# EAGLE design QuadFM (EAGLE 7.6.0)
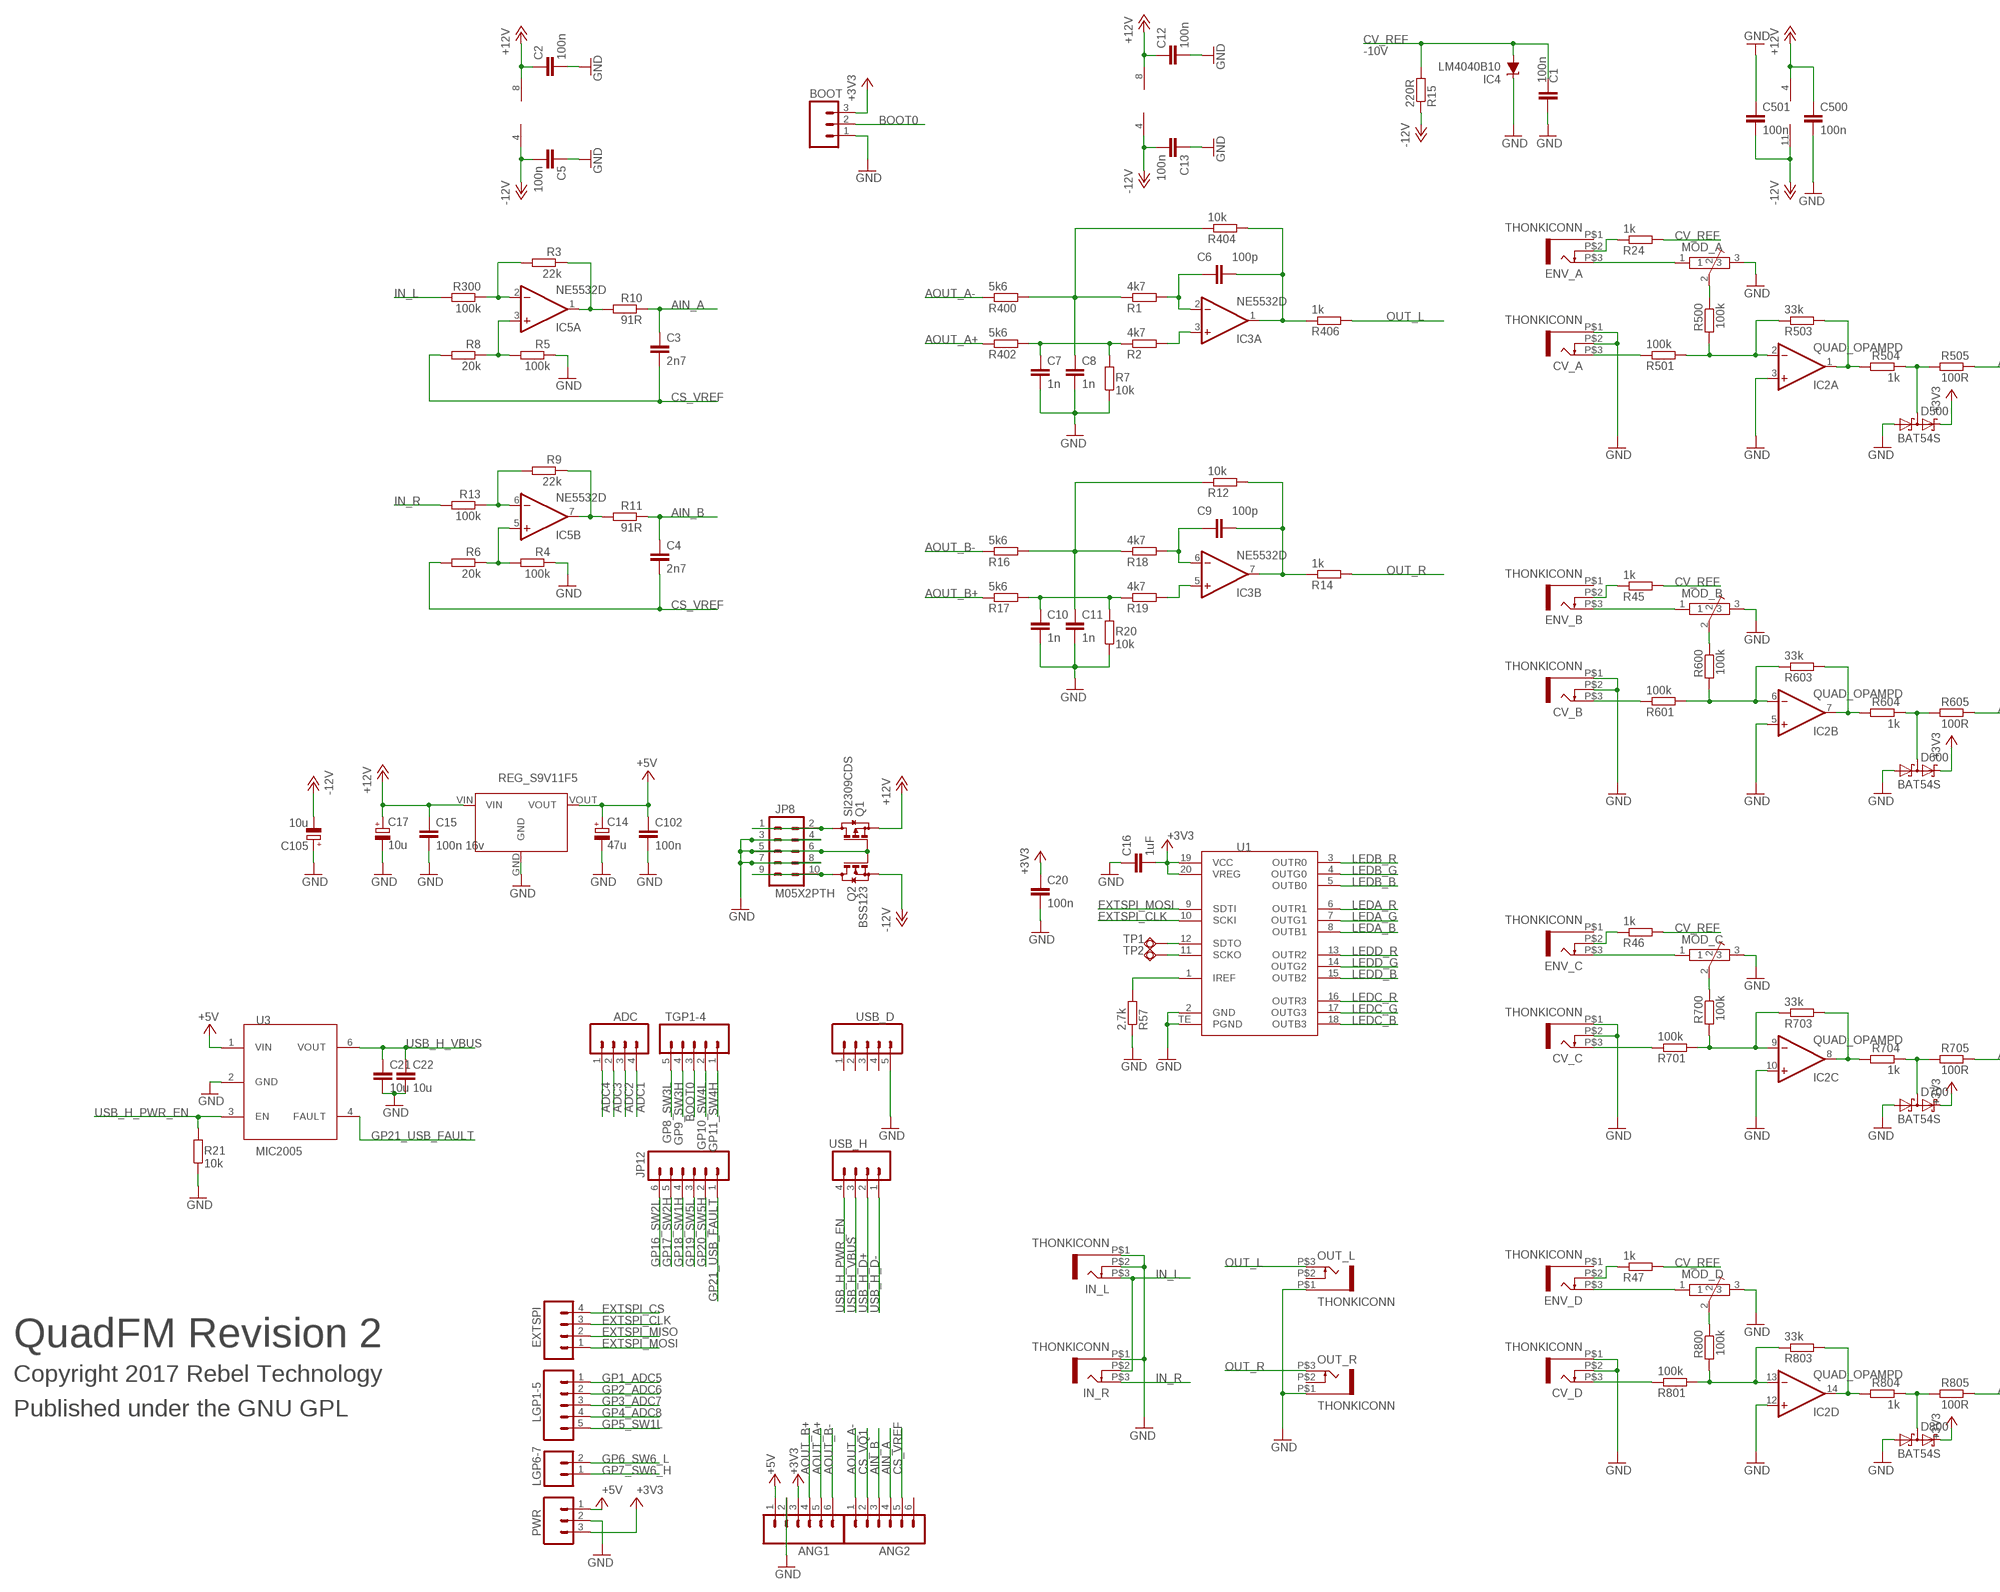
[diagram p0: schematic, sheet 1, part 1 of 2]
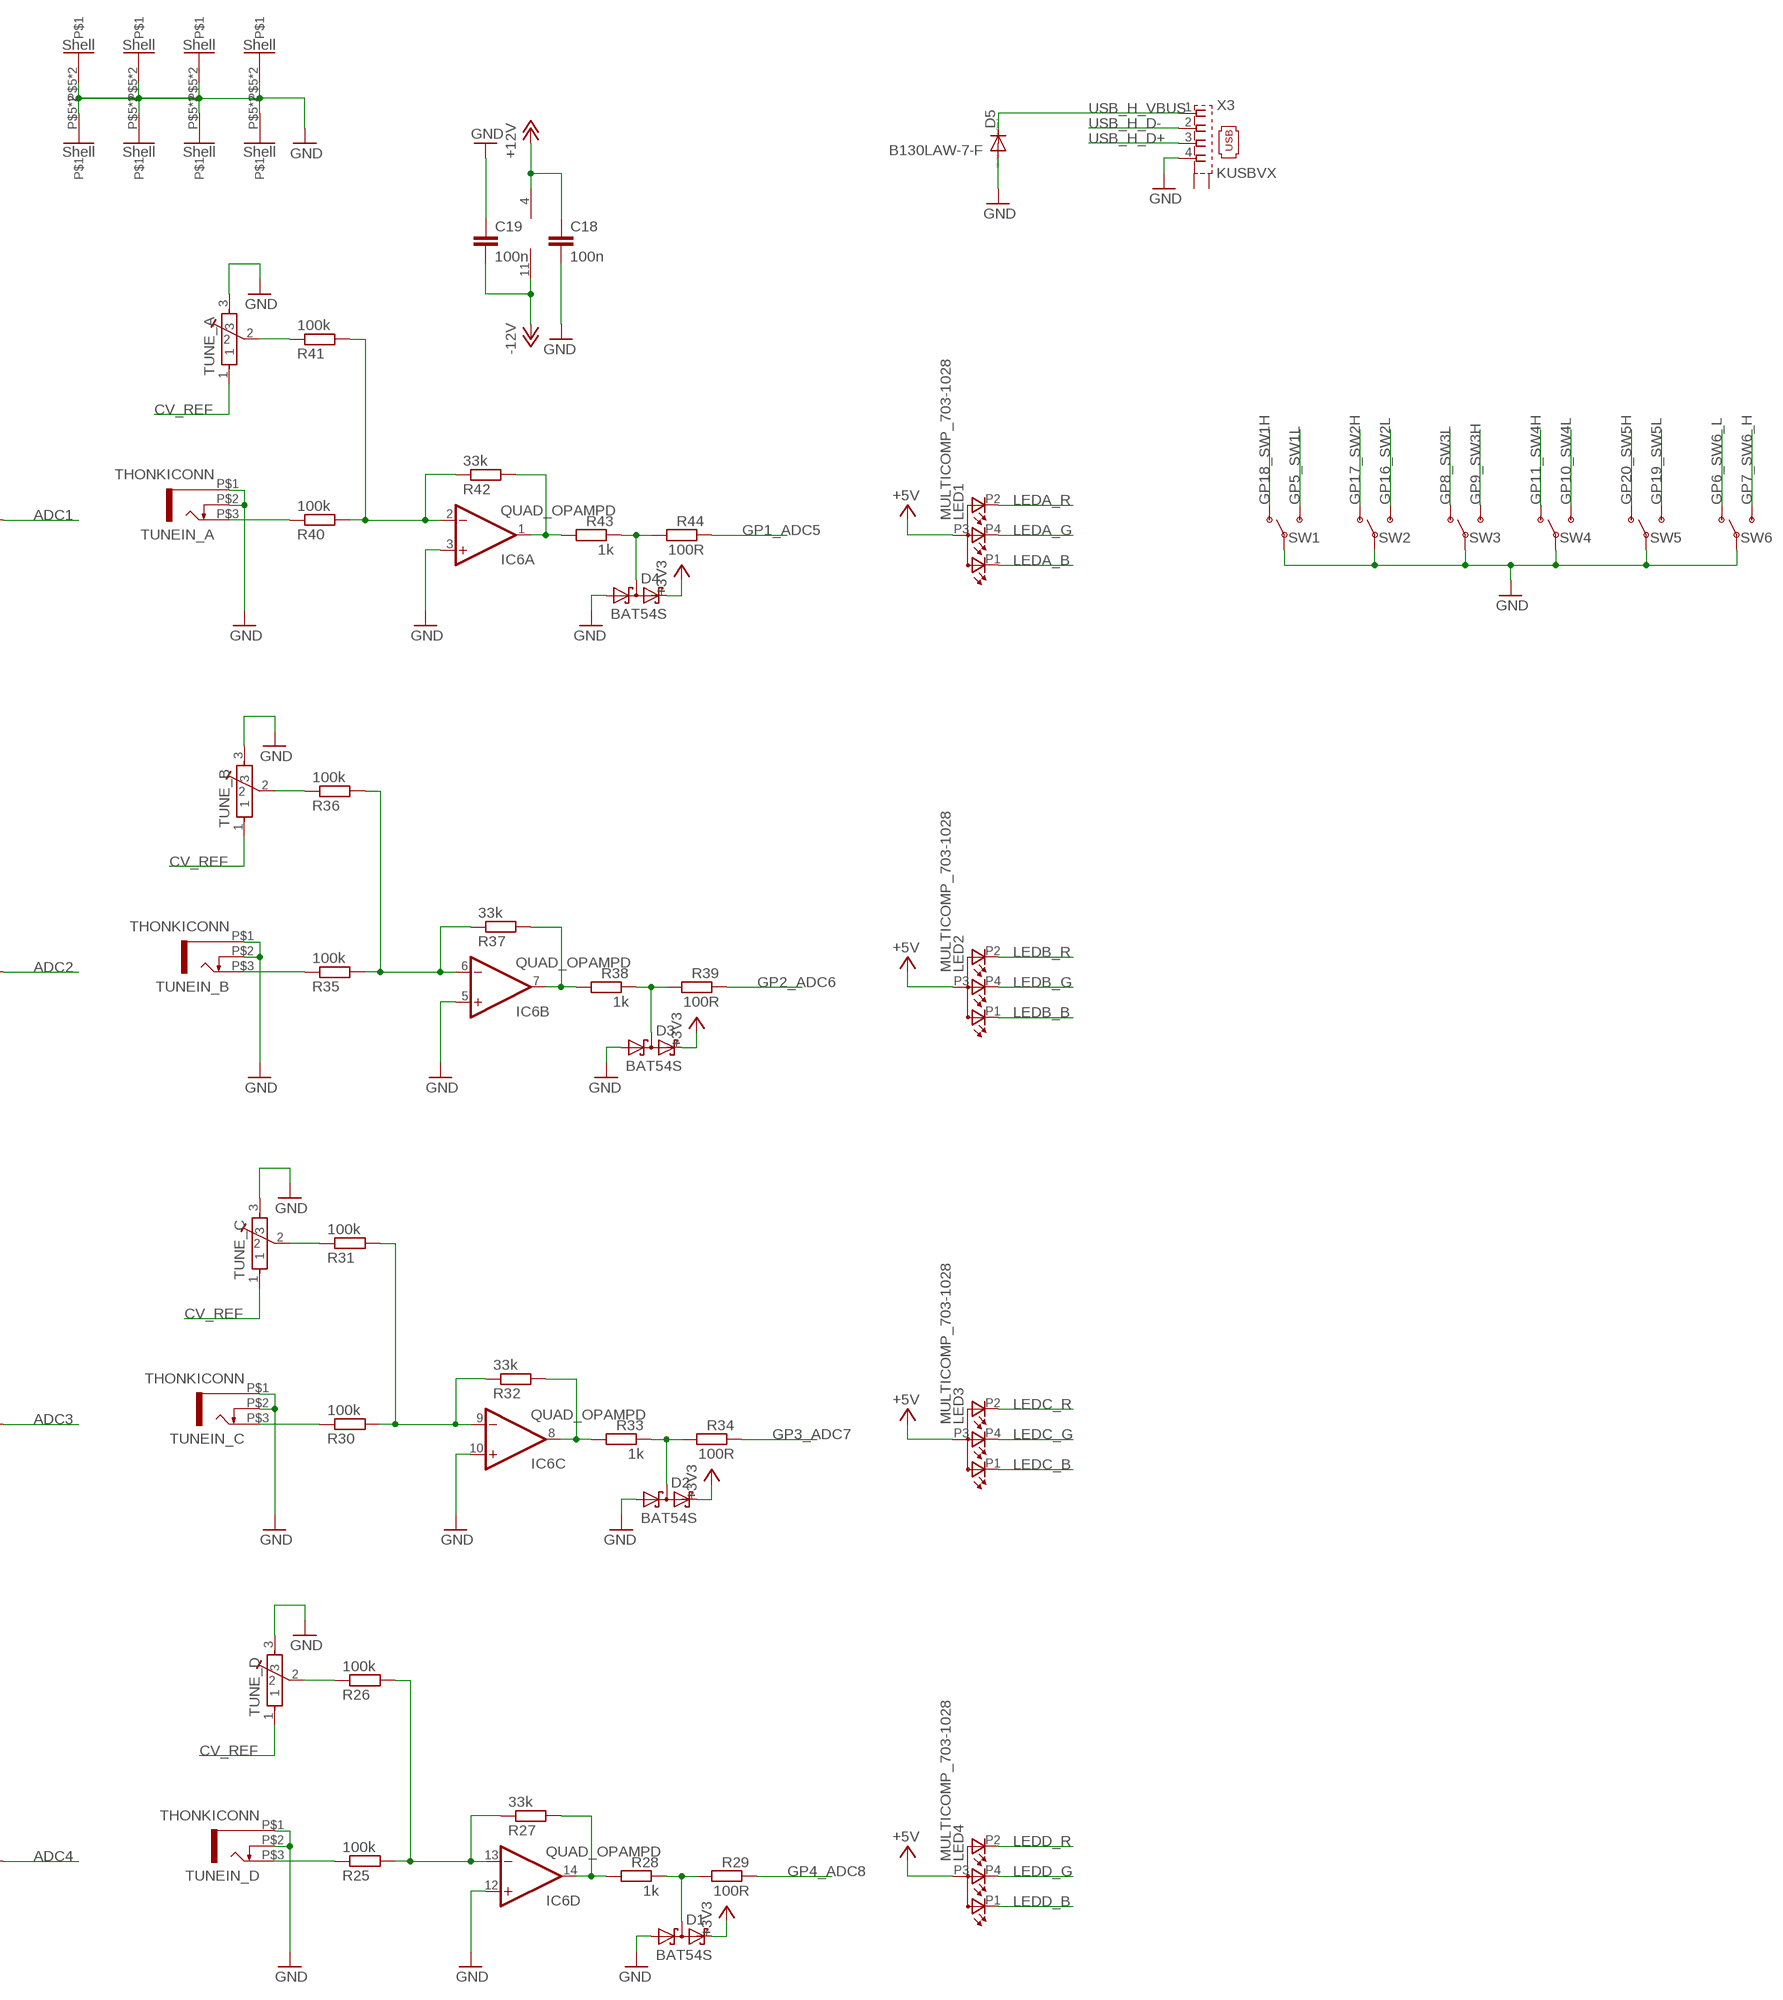
[diagram p1: schematic, sheet 1, part 2 of 2]

## Parts
ADC  M04PTH  [1X04]
ANG1  M06SIP  [1X06]
ANG2  M06SIP  [1X06]
BOOT  M03PTH  [1X03]
C1  100n  C-EUC0603  [C0603]
C2  100n  C-EUC0603  [C0603]
C3  2n7  C-EUC0603  [C0603]
C4  2n7  C-EUC0603  [C0603]
C5  100n  C-EUC0603  [C0603]
C6  100p  C-EUC0603  [C0603]
C7  1n  C-EUC0603  [C0603]
C8  1n  C-EUC0603  [C0603]
C9  100p  C-EUC0603  [C0603]
C10  1n  C-EUC0603  [C0603]
C11  1n  C-EUC0603  [C0603]
C12  100n  C-EUC0603  [C0603]
C13  100n  C-EUC0603  [C0603]
C14  47u  CPOL-EU153CLV-0505  [CPOL-5]
C15  100n 16v  C-EUC0603  [C0603]
C16  1uF  C-EUC0603  [C0603]
C17  10u  CPOL-EU153CLV-0405  [153CLV-0405]
C18  100n  C-EUC0603  [C0603]
C19  100n  C-EUC0603  [C0603]
C20  100n  C-EUC0603  [C0603]
C21  10u  C-EUC0603  [C0603]
C22  10u  C-EUC0603  [C0603]
C102  100n  C-EUC0603  [C0603]
C105  10u  CPOL-EU153CLV-0405  [153CLV-0405]
C500  100n  C-EUC0603  [C0603]
C501  100n  C-EUC0603  [C0603]
CV_A  THONKICONN  [THONKICONN]
CV_B  THONKICONN  [THONKICONN]
CV_C  THONKICONN  [THONKICONN]
CV_D  THONKICONN  [THONKICONN]
D1  BAT54S  [SOT23]
D2  BAT54S  [SOT23]
D3  BAT54S  [SOT23]
D4  BAT54S  [SOT23]
D5  B130LAW-7-F  DIODE-SOD123  [SOD123]
D500  BAT54S  [SOT23]
D600  BAT54S  [SOT23]
D700  BAT54S  [SOT23]
D800  BAT54S  [SOT23]
ENV_A  THONKICONN  [THONKICONN]
ENV_B  THONKICONN  [THONKICONN]
ENV_C  THONKICONN  [THONKICONN]
ENV_D  THONKICONN  [THONKICONN]
EXTSPI  M04PTH  [1X04]
IC2  QUAD_OPAMPD  [SO14]
IC3  NE5532D  [SO08]
IC4  LM4040B10  LM4041C12DBZ  [DBZ_R-PDSO-G3]
IC5  NE5532D  [SO08]
IC6  QUAD_OPAMPD  [SO14]
IN_L  THONKICONN  [THONKICONN]
IN_R  THONKICONN  [THONKICONN]
JP8  M05X2PTH  [AVR_ICSP]
JP12  M06SIP  [1X06]
LED1  MULTICOMP_703-1028  [RGB-LED-703-1028]
LED2  MULTICOMP_703-1028  [RGB-LED-703-1028]
LED3  MULTICOMP_703-1028  [RGB-LED-703-1028]
LED4  MULTICOMP_703-1028  [RGB-LED-703-1028]
LGP1-5  M05PTH  [1X05]
LGP6-7  M02PTH  [1X02]
MOD_A  POT-ALPS-RK09L1140  [POT-ALPS-RK09L1140]
MOD_B  POT-ALPS-RK09L1140  [POT-ALPS-RK09L1140]
MOD_C  POT-ALPS-RK09L1140  [POT-ALPS-RK09L1140]
MOD_D  POT-ALPS-RK09L1140  [POT-ALPS-RK09L1140]
OUT_L  THONKICONN  [THONKICONN]
OUT_R  THONKICONN  [THONKICONN]
PWR  M03PTH  [1X03]
Q1  SI2309CDS  BSS84  [SOT23]
Q2  BSS123  [SOT23]
R1  4k7  R-EU_0603  [0603]
R2  4k7  R-EU_0603  [0603]
R3  22k  R-EU_0603  [0603]
R4  100k  R-EU_0603  [0603]
R5  100k  R-EU_0603  [0603]
R6  20k  R-EU_0603  [0603]
R7  10k  R-EU_0603  [0603]
R8  20k  R-EU_0603  [0603]
R9  22k  R-EU_0603  [0603]
R10  91R  R-EU_0603  [0603]
R11  91R  R-EU_0603  [0603]
R12  10k  R-EU_0603  [0603]
R13  100k  R-EU_0603  [0603]
R14  1k  R-EU_0603  [0603]
R15  220R  R-EU_0603  [0603]
R16  5k6  R-EU_0603  [0603]
R17  5k6  R-EU_0603  [0603]
R18  4k7  R-EU_0603  [0603]
R19  4k7  R-EU_0603  [0603]
R20  10k  R-EU_0603  [0603]
R21  10k  R-EU_0603  [0603]
R24  1k  R-EU_0603  [0603]
R25  100k  R-EU_0603  [0603]
R26  100k  R-EU_0603  [0603]
R27  33k  R-EU_0603  [0603]
R28  1k  R-EU_0603  [0603]
R29  100R  R-EU_0603  [0603]
R30  100k  R-EU_0603  [0603]
R31  100k  R-EU_0603  [0603]
R32  33k  R-EU_0603  [0603]
R33  1k  R-EU_0603  [0603]
R34  100R  R-EU_0603  [0603]
R35  100k  R-EU_0603  [0603]
R36  100k  R-EU_0603  [0603]
R37  33k  R-EU_0603  [0603]
R38  1k  R-EU_0603  [0603]
R39  100R  R-EU_0603  [0603]
R40  100k  R-EU_0603  [0603]
R41  100k  R-EU_0603  [0603]
R42  33k  R-EU_0603  [0603]
R43  1k  R-EU_0603  [0603]
R44  100R  R-EU_0603  [0603]
R45  1k  R-EU_0603  [0603]
R46  1k  R-EU_0603  [0603]
R47  1k  R-EU_0603  [0603]
R57  2.7k  R-EU_0603  [0603]
R300  100k  R-EU_0603  [0603]
R400  5k6  R-EU_0603  [0603]
R402  5k6  R-EU_0603  [0603]
R404  10k  R-EU_0603  [0603]
R406  1k  R-EU_0603  [0603]
R500  100k  R-EU_0603  [0603]
R501  100k  R-EU_0603  [0603]
R503  33k  R-EU_0603  [0603]
R504  1k  R-EU_0603  [0603]
R505  100R  R-EU_0603  [0603]
R600  100k  R-EU_0603  [0603]
R601  100k  R-EU_0603  [0603]
R603  33k  R-EU_0603  [0603]
R604  1k  R-EU_0603  [0603]
R605  100R  R-EU_0603  [0603]
R700  100k  R-EU_0603  [0603]
R701  100k  R-EU_0603  [0603]
R703  33k  R-EU_0603  [0603]
R704  1k  R-EU_0603  [0603]
R705  100R  R-EU_0603  [0603]
R800  100k  R-EU_0603  [0603]
R801  100k  R-EU_0603  [0603]
R803  33k  R-EU_0603  [0603]
R804  1k  R-EU_0603  [0603]
R805  100R  R-EU_0603  [0603]
SW1  SUB-MIN-SPDT  [SUB-MIN-SPDT]
SW2  SUB-MIN-SPDT  [SUB-MIN-SPDT]
SW3  SUB-MIN-SPDT  [SUB-MIN-SPDT]
SW4  SUB-MIN-SPDT  [SUB-MIN-SPDT]
SW5  SUB-MIN-SPDT  [SUB-MIN-SPDT]
SW6  SUB-MIN-SPDT  [SUB-MIN-SPDT]
TGP1-4  M05PTH  [1X05]
TP1  TPSQPAD1-13  [P1-13]
TP2  TPSQPAD1-13  [P1-13]
TUNE_A  POT-ALPS-RK09L1140  [POT-ALPS-RK09L1140]
TUNE_B  POT-ALPS-RK09L1140  [POT-ALPS-RK09L1140]
TUNE_C  POT-ALPS-RK09L1140  [POT-ALPS-RK09L1140]
TUNE_D  POT-ALPS-RK09L1140  [POT-ALPS-RK09L1140]
TUNEIN_A  THONKICONN  [THONKICONN]
TUNEIN_B  THONKICONN  [THONKICONN]
TUNEIN_C  THONKICONN  [THONKICONN]
TUNEIN_D  THONKICONN  [THONKICONN]
U1  TLC5971  TLC5971QFN  [TSSOP20-TE]
U3  MIC2005  [SOT23-6]
U$1  REG_S9V11F5  [REG_S9V11F5]
USB_D  M05PTH  [1X05]
USB_H  M04PTH  [1X04]
X3  KUSBVX  [KUSBVX]

## Nets
+3V3: ANG1.3 BOOT.3 C16.2 C20.1 D1.2(C2) D2.2(C2) D3.2(C2) D4.2(C2) D500.2(C2) D600.2(C2) D700.2(C2) D800.2(C2) PWR.3 U1.19(VCC) U1.20(VREG)
+5V: ANG1.1 C14.+ C102.1 LED1.P3(A) LED2.P3(A) LED3.P3(A) LED4.P3(A) PWR.1 U3.1(VIN) U$1.VOUT
+12V: C2.1 C12.1 C15.1 C17.+ C18.1 C500.1 IC2.4(P:V+) IC3.8(P:V+) IC5.8(P:V+) IC6.4(P:V+) Q1.2(S) U$1.VIN
-12V: C5.2 C13.2 C19.2 C105.- C501.2 IC2.11(P:V-) IC3.4(P:V-) IC5.4(P:V-) IC6.11(P:V-) Q2.2(S) R15.1
ADC1: ADC.4 R505.1
ADC2: ADC.3 R605.1
ADC3: ADC.2 R705.1
ADC4: ADC.1 R805.1
AIN_A: ANG2.4 C3.1 R10.1
AIN_B: ANG2.3 C4.1 R11.1
AOUT_A+: ANG1.5 R402.1
AOUT_A-: ANG2.1 R400.1
AOUT_B+: ANG1.4 R17.1
AOUT_B-: ANG1.6 R16.1
BOOT0: BOOT.2 TGP1-4.3
CS_VQ1: ANG2.2
CS_VREF: ANG2.5 C3.2 C4.2 R6.2 R8.2
CV_REF: C1.1 IC4.2(A) R15.2 R24.2 R45.2 R46.2 R47.2 TUNE_A.1 TUNE_B.1 TUNE_C.1 TUNE_D.1
EXTSPI_CLK: EXTSPI.3 U1.10(SCKI)
EXTSPI_CS: EXTSPI.4
EXTSPI_MISO: EXTSPI.2
EXTSPI_MOSI: EXTSPI.1 U1.9(SDTI)
GND: ANG1.2 BOOT.1 C1.2 C2.2 C5.1 C7.2 C8.2 C10.2 C11.2 C12.2 C13.1 C14.- C15.2 C16.1 C17.- C18.2 C19.1 C20.2 C21.2 C22.2 C102.2 C105.+ C500.2 C501.1 CV_A.P$1 CV_A.P$2 CV_B.P$1 CV_B.P$2 CV_C.P$1 CV_C.P$2 CV_D.P$1 CV_D.P$2 D1.1(A1) D2.1(A1) D3.1(A1) D4.1(A1) D5.A D500.1(A1) D600.1(A1) D700.1(A1) D800.1(A1) IC2.3(A:+IN) IC2.5(B:+IN) IC2.10(C:+IN) IC2.12(D:+IN) IC4.1(C) IC6.3(A:+IN) IC6.5(B:+IN) IC6.10(C:+IN) IC6.12(D:+IN) IN_L.P$1 IN_L.P$2 IN_R.P$1 JP8.3 JP8.4 JP8.5 JP8.6 JP8.7 JP8.8 MOD_A.3 MOD_A.P$5 MOD_A.P$6 MOD_B.3 MOD_B.P$5 MOD_B.P$6 MOD_C.3 MOD_C.P$5 MOD_C.P$6 MOD_D.3 MOD_D.P$5 MOD_D.P$6 OUT_L.P$1 OUT_R.P$1 PWR.2 Q1.1(G) Q2.1(G) R4.1 R5.1 R7.1 R20.1 R21.1 R57.1 SW1.2(P) SW2.2(P) SW3.2(P) SW4.2(P) SW5.2(P) SW6.2(P) TUNE_A.3 TUNE_A.P$5 TUNE_A.P$6 TUNE_B.3 TUNE_B.P$5 TUNE_B.P$6 TUNE_C.3 TUNE_C.P$5 TUNE_C.P$6 TUNE_D.3 TUNE_D.P$5 TUNE_D.P$6 TUNEIN_A.P$1 TUNEIN_A.P$2 TUNEIN_B.P$1 TUNEIN_B.P$2 TUNEIN_C.P$1 TUNEIN_C.P$2 TUNEIN_D.P$1 TUNEIN_D.P$2 U1.2(GND) U1.TE(PGND) U3.2(GND) U$1.GND USB_D.5 X3.4
GP1_ADC5: LGP1-5.1 R44.1
GP2_ADC6: LGP1-5.2 R39.1
GP3_ADC7: LGP1-5.3 R34.1
GP4_ADC8: LGP1-5.4 R29.1
GP5_SW1L: LGP1-5.5 SW1.3(S)
GP6_SW6_L: LGP6-7.2 SW6.1(O)
GP7_SW6_H: LGP6-7.1 SW6.3(S)
GP8_SW3L: SW3.1(O) TGP1-4.5
GP9_SW3H: SW3.3(S) TGP1-4.4
GP10_SW4L: SW4.3(S) TGP1-4.2
GP11_SW4H: SW4.1(O) TGP1-4.1
GP16_SW2L: JP12.6 SW2.3(S)
GP17_SW2H: JP12.5 SW2.1(O)
GP18_SW1H: JP12.4 SW1.1(O)
GP19_SW5L: JP12.3 SW5.3(S)
GP20_SW5H: JP12.2 SW5.1(O)
GP21_USB_FAULT: JP12.1 U3.4(FAULT)
IN_L: IN_L.P$3 IN_R.P$2 R300.2
IN_R: IN_R.P$3 R13.2
LEDA_B: LED1.P1(CRED) U1.8(OUTB1)
LEDA_G: LED1.P4(CBLUE) U1.7(OUTG1)
LEDA_R: LED1.P2(CGREEN) U1.6(OUTR1)
LEDB_B: LED2.P1(CRED) U1.5(OUTB0)
LEDB_G: LED2.P4(CBLUE) U1.4(OUTG0)
LEDB_R: LED2.P2(CGREEN) U1.3(OUTR0)
LEDC_B: LED3.P1(CRED) U1.18(OUTB3)
LEDC_G: LED3.P4(CBLUE) U1.17(OUTG3)
LEDC_R: LED3.P2(CGREEN) U1.16(OUTR3)
LEDD_B: LED4.P1(CRED) U1.15(OUTB2)
LEDD_G: LED4.P4(CBLUE) U1.14(OUTG2)
LEDD_R: LED4.P2(CGREEN) U1.13(OUTR2)
N$1: IC5.1(A:OUT) R3.1 R10.2
N$2: IC5.3(A:+IN) R5.2 R8.1
N$3: CV_A.P$3 R501.1
N$4: IC5.5(B:+IN) R4.2 R6.1
N$5: IC5.6(B:-IN) R9.2 R13.1
N$6: IC2.9(C:-IN) R700.2 R701.2 R703.1
N$7: C6.1 IC3.2(A:-IN) R1.2
N$8: JP8.9 JP8.10 Q2.3(D)
N$9: IC5.2(A:-IN) R3.2 R300.1
N$10: IC5.7(B:OUT) R9.1 R11.2
N$11: IC3.3(A:+IN) R2.2
N$12: JP8.1 JP8.2 Q1.3(D)
N$13: IC2.2(A:-IN) R500.2 R501.2 R503.1
N$14: MOD_A.2 R500.1
N$15: C7.1 R2.1 R7.2 R402.2
N$16: D500.3(C1A2) R504.1 R505.2
N$17: IC2.1(A:OUT) R503.2 R504.2
N$18: C9.2 IC3.7(B:OUT) R12.2 R14.1
N$19: CV_B.P$3 R601.1
N$20: IC2.6(B:-IN) R600.2 R601.2 R603.1
N$21: MOD_B.2 R600.1
N$22: IC2.7(B:OUT) R603.2 R604.2
N$23: D600.3(C1A2) R604.1 R605.2
N$24: C11.1 R12.1 R16.2 R18.1
N$25: CV_C.P$3 R701.1
N$26: C9.1 IC3.6(B:-IN) R18.2
N$27: MOD_C.2 R700.1
N$28: IC2.8(C:OUT) R703.2 R704.2
N$29: D700.3(C1A2) R704.1 R705.2
N$30: IC3.5(B:+IN) R19.2
N$31: CV_D.P$3 R801.1
N$32: C10.1 R17.2 R19.1 R20.2
N$33: IC2.13(D:-IN) R800.2 R801.2 R803.1
N$34: MOD_D.2 R800.1
N$35: IC2.14(D:OUT) R803.2 R804.2
N$36: D800.3(C1A2) R804.1 R805.2
N$38: ENV_A.P$2 R24.1
N$39: C6.2 IC3.1(A:OUT) R404.2 R406.1
N$40: TP1.TP U1.12(SDTO)
N$41: C8.1 R1.1 R400.2 R404.1
N$42: TP2.TP U1.11(SCKO)
N$44: ENV_A.P$3 MOD_A.1
N$45: R25.1 TUNEIN_D.P$3
N$46: R57.2 U1.1(IREF)
N$47: IC6.13(D:-IN) R25.2 R26.2 R27.1
N$48: R26.1 TUNE_D.2
N$49: IC6.14(D:OUT) R27.2 R28.2
N$50: D1.3(C1A2) R28.1 R29.2
N$51: R30.1 TUNEIN_C.P$3
N$52: IC6.9(C:-IN) R30.2 R31.2 R32.1
N$53: R31.1 TUNE_C.2
N$54: IC6.8(C:OUT) R32.2 R33.2
N$55: D2.3(C1A2) R33.1 R34.2
N$56: R35.1 TUNEIN_B.P$3
N$57: IC6.6(B:-IN) R35.2 R36.2 R37.1
N$58: R36.1 TUNE_B.2
N$59: IC6.7(B:OUT) R37.2 R38.2
N$60: D3.3(C1A2) R38.1 R39.2
N$61: R40.1 TUNEIN_A.P$3
N$62: IC6.2(A:-IN) R40.2 R41.2 R42.1
N$63: R41.1 TUNE_A.2
N$64: IC6.1(A:OUT) R42.2 R43.2
N$65: D4.3(C1A2) R43.1 R44.2
N$66: ENV_B.P$2 R45.1
N$67: ENV_B.P$3 MOD_B.1
N$68: ENV_C.P$2 R46.1
N$69: ENV_C.P$3 MOD_C.1
N$70: ENV_D.P$2 R47.1
N$71: ENV_D.P$3 MOD_D.1
OUT_L: OUT_L.P$3 R406.2
OUT_R: OUT_R.P$3 R14.2
USB_H_D+: USB_H.2 X3.3
USB_H_D-: USB_H.1 X3.2
USB_H_PWR_EN: R21.2 U3.3(EN) USB_H.4
USB_H_VBUS: C21.1 C22.1 D5.C U3.6(VOUT) USB_H.3 X3.1
Unconnected: ANG2.6 ENV_A.P$1 ENV_B.P$1 ENV_C.P$1 ENV_D.P$1 OUT_L.P$2 OUT_R.P$2 USB_D.1 USB_D.2 USB_D.3 USB_D.4 X3.M1(S1) X3.M2(S2)

## Notes on the sheet
- -10V
- QuadFM Revision 2
- Copyright 2017 Rebel Technology
- Published under the GNU GPL

## Library data of the parts
ADC EXTSPI USB_H = SparkFun:M04: Header 4 Standard 4-pin 0.1" header. Use with straight break away headers (SKU : PRT-00116), right angle break away headers (PRT-00553), swiss pins (PRT-00743), machine pins (PRT-00117), and female headers (PRT-00115). Molex polarized connector foot print use with SKU : PRT-08231 with associated crimp pins and housings. 1MM SMD Version SKU: PRT-10208
ANG1 ANG2 JP12 = SparkFun:M06: Header 6 Standard 6-pin 0.1" header. Use with straight break away headers (SKU : PRT-00116), right angle break away headers (PRT-00553), swiss pins (PRT-00743), machine pins (PRT-00117), and female headers (PRT-00115). Molex polarized connector foot print use with SKU : PRT-08094 with associated crimp pins and housings. NOTES ON THE VARIANTS LOCK and LOCK_LONGPADS... This footprint was designed to help hold the alignment of a through-hole component (i.e. 6-pin header) while soldering it into place. You may notice that each hole has been shifted either up or down by 0.005 of an inch from it's more standard position (which is a perfectly straight line). This slight alteration caused the pins (the squares in the middle) to touch the edges of the holes. Because they are alternating, it causes a "brace" to hold the component in place. 0.005 has proven to be the perfect amount of "off-center" position when using our standard breakaway headers. Although looks a little odd when you look at the bare footprint, once you have a header in there, the alteration is very hard to notice. Also, if you push a header all the way into place, it is covered up entirely on the bottom side. This idea of altering the position of holes to aid alignment will be further integrated into the Sparkfun Library for other footprints. It can help hold any component with 3 or more connection pins.
BOOT PWR = SparkFun:M03: Header 3 Standard 3-pin 0.1" header. Use with straight break away headers (SKU : PRT-00116), right angle break away headers (PRT-00553), swiss pins (PRT-00743), machine pins (PRT-00117), and female headers (PRT-00115). Molex polarized connector foot print use with SKU : PRT-08232 with associated crimp pins and housings.
C1-C13 C18-C22 C500 C501 = resistor:C-EU: CAPACITOR, European symbol
C14 C17 C105 = Rebel:CPOL-EU: POLARIZED CAPACITOR, European symbol
C15 C16 C102 = Rebel:C-EU: CAPACITOR, European symbol
CV_A CV_B CV_C CV_D ENV_A ENV_B ENV_C ENV_D IN_L IN_R OUT_L OUT_R TUNEIN_A TUNEIN_B TUNEIN_C TUNEIN_D = Rebel:THONKICONN
D1-D4 D500 D600 D700 D800 = diode:BAT54S: Schottky Diodes Pin connection corrected 2011-05-04 Source: Fairchild .. BAT54.pdf
D5 = diode:DIODE-: DIODE; OC_FARNELL: 1858617
IC2 IC6 = adafruit:QUAD_OPAMP: OP AMP Standard quad package
IC3 IC5 = linear:NE5532: AUDIO AMPLIFIER
IC4 = texas:LM4041: PRECISION MICROPOWER SHUNT VOLTAGE REFERENCE Source: http://focus.ti.com/lit/ds/slcs146e/slcs146e.pdf; MF: TEXAS INSTRUMENT CONNECTORS; MPN: LM4041C12QDBZT; OC_FARNELL: 1771733; OC_NEWARK: 43K3376
JP8 = SparkFun:M05X2: Header 5x2 Standard 10-pin dual row 0.1" header. Commonly used with AVR-ISP. Use with Spark Fun Electronics SKU: PRT-00778
LED1-LED4 = Rebel:MULTICOMP_703-1028: Farnell: 2112143
LGP1-5 TGP1-4 USB_D = SparkFun:M05: Header 5 Standard 5-pin 0.1" header. Use with straight break away headers (SKU : PRT-00116), right angle break away headers (PRT-00553), swiss pins (PRT-00743), machine pins (PRT-00117), and female headers (PRT-00115). Molex polarized connector foot print use with SKU : PRT-08230 with associated crimp pins and housings.
LGP6-7 = SparkFun:M02: Header 2 Standard 2-pin 0.1" header. Use with straight break away headers (SKU : PRT-00116), right angle break away headers (PRT-00553), swiss pins (PRT-00743), machine pins (PRT-00117), and female headers (PRT-00115). Molex polarized connector foot print use with SKU : PRT-08233 with associated crimp pins and housings.
MOD_A MOD_B MOD_C MOD_D TUNE_A TUNE_B TUNE_C TUNE_D = Rebel:POT-ALPS-RK09L
Q1 = transistor-small-signal:BSS84: P-CHANNEL MOS FET; OC_FARNELL: 1779264
Q2 = transistor-small-signal:BSS123: N-CHANNEL MOS FET; OC_FARNELL: 1843725
R1-R21 R24-R47 R57 R300 R400 R402 R404 R406 R500 R501 R503-R505 R600 R601 R603-R605 R700 R701 R703-R705 R800 R801 R803-R805 = Rebel:R-EU_: RESISTOR, European symbol
SW1-SW6 = Rebel:SUB-MIN-SPDT
TP1 TP2 = testpad:TPSQ: Test pad
U1 = Rebel:TLC5971
U3 = James:MIC2005; OC_FARNELL: 2509882
U$1 = Rebel:REG_S9V11F5
X3 = con-kycon:KUSBVX: Vertical,Top Entry Universal Serial Bus Connector KUSBVX Series Source: KYCON Sibalco USB vertical socket KUSBV.pdf

## Net classes
1 power: width 0.178 mm, drill 0.305 mm, clearance 0.178 mm to class 0, clearance 0.178 mm

## Board
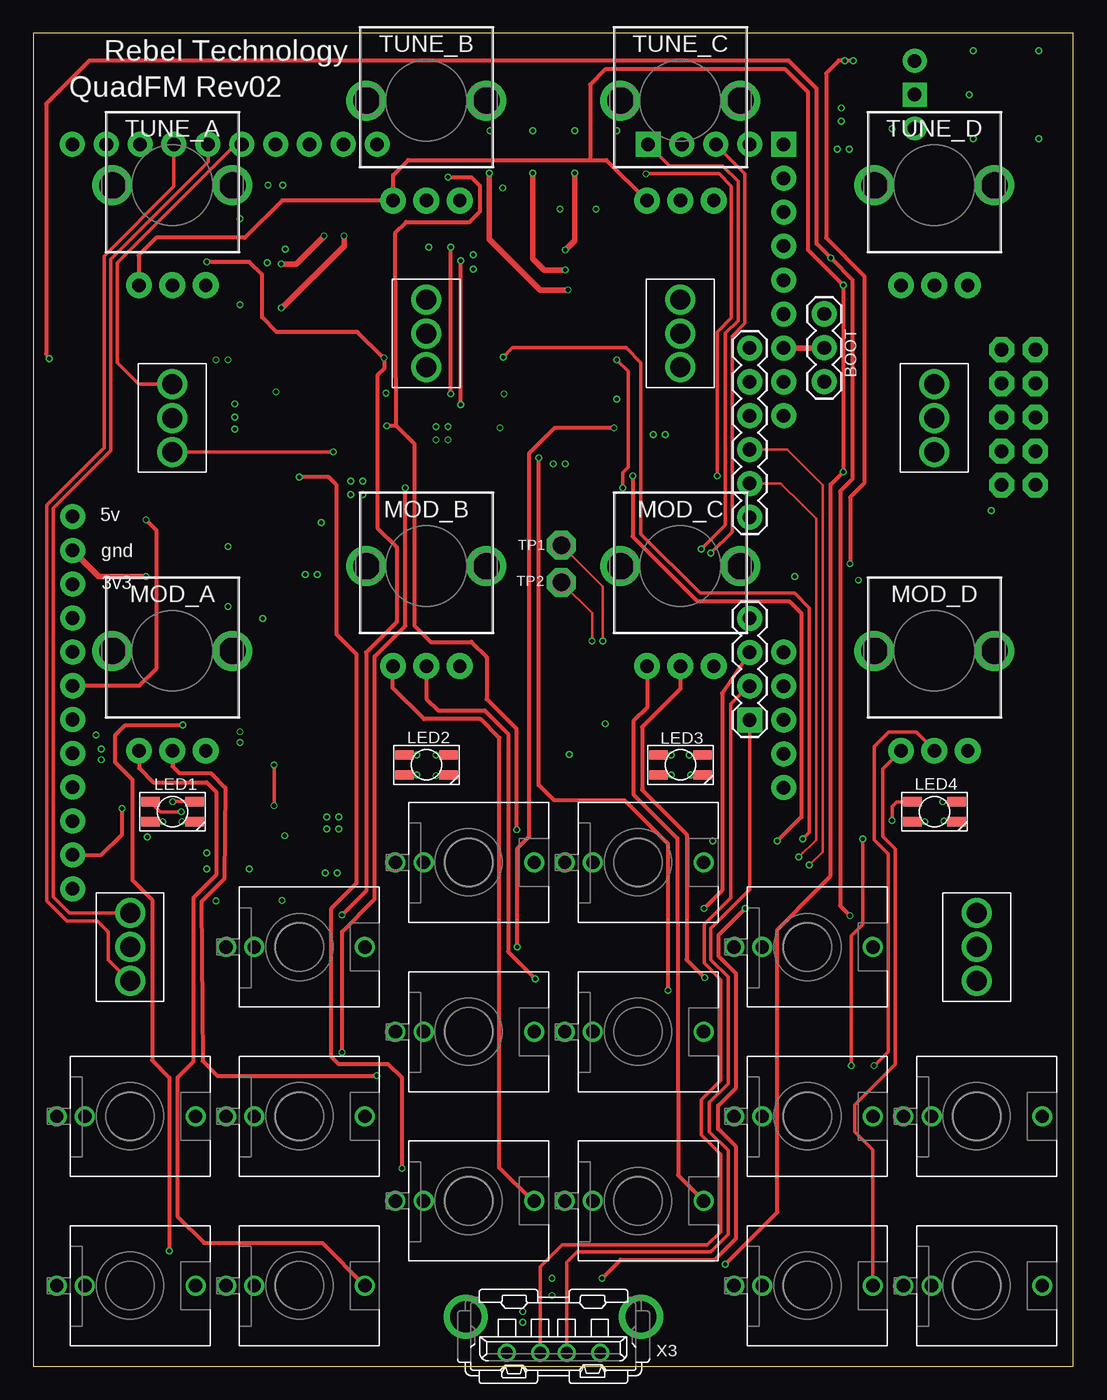
[diagram p2: board, top side]
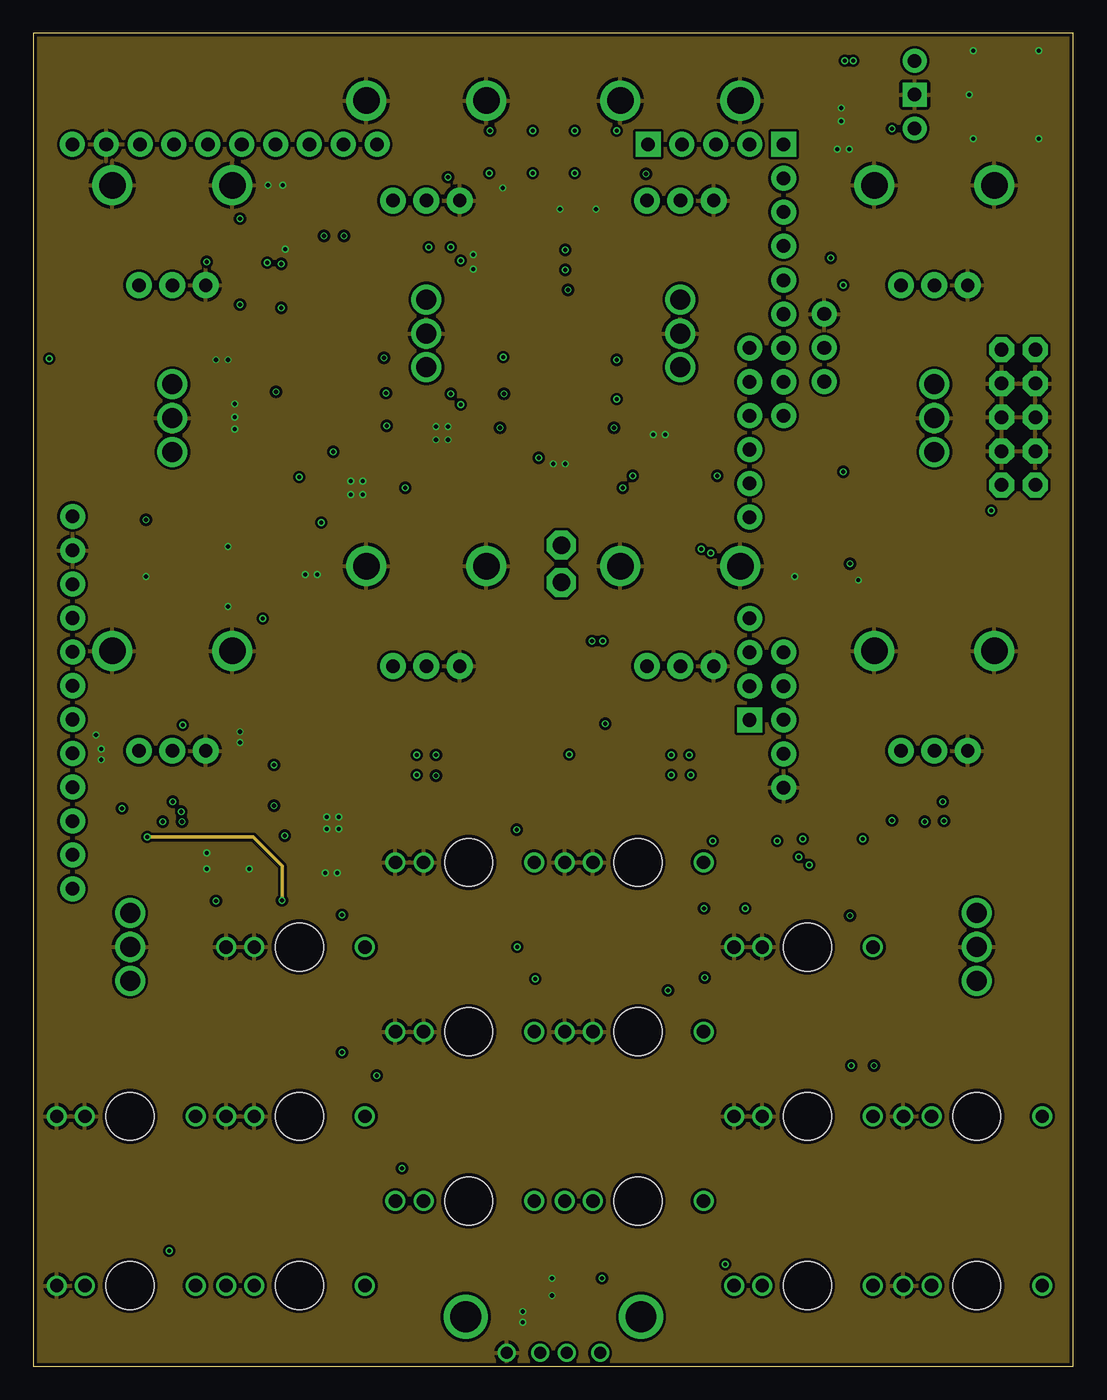
[diagram p3: board, inner layer InnerTop]
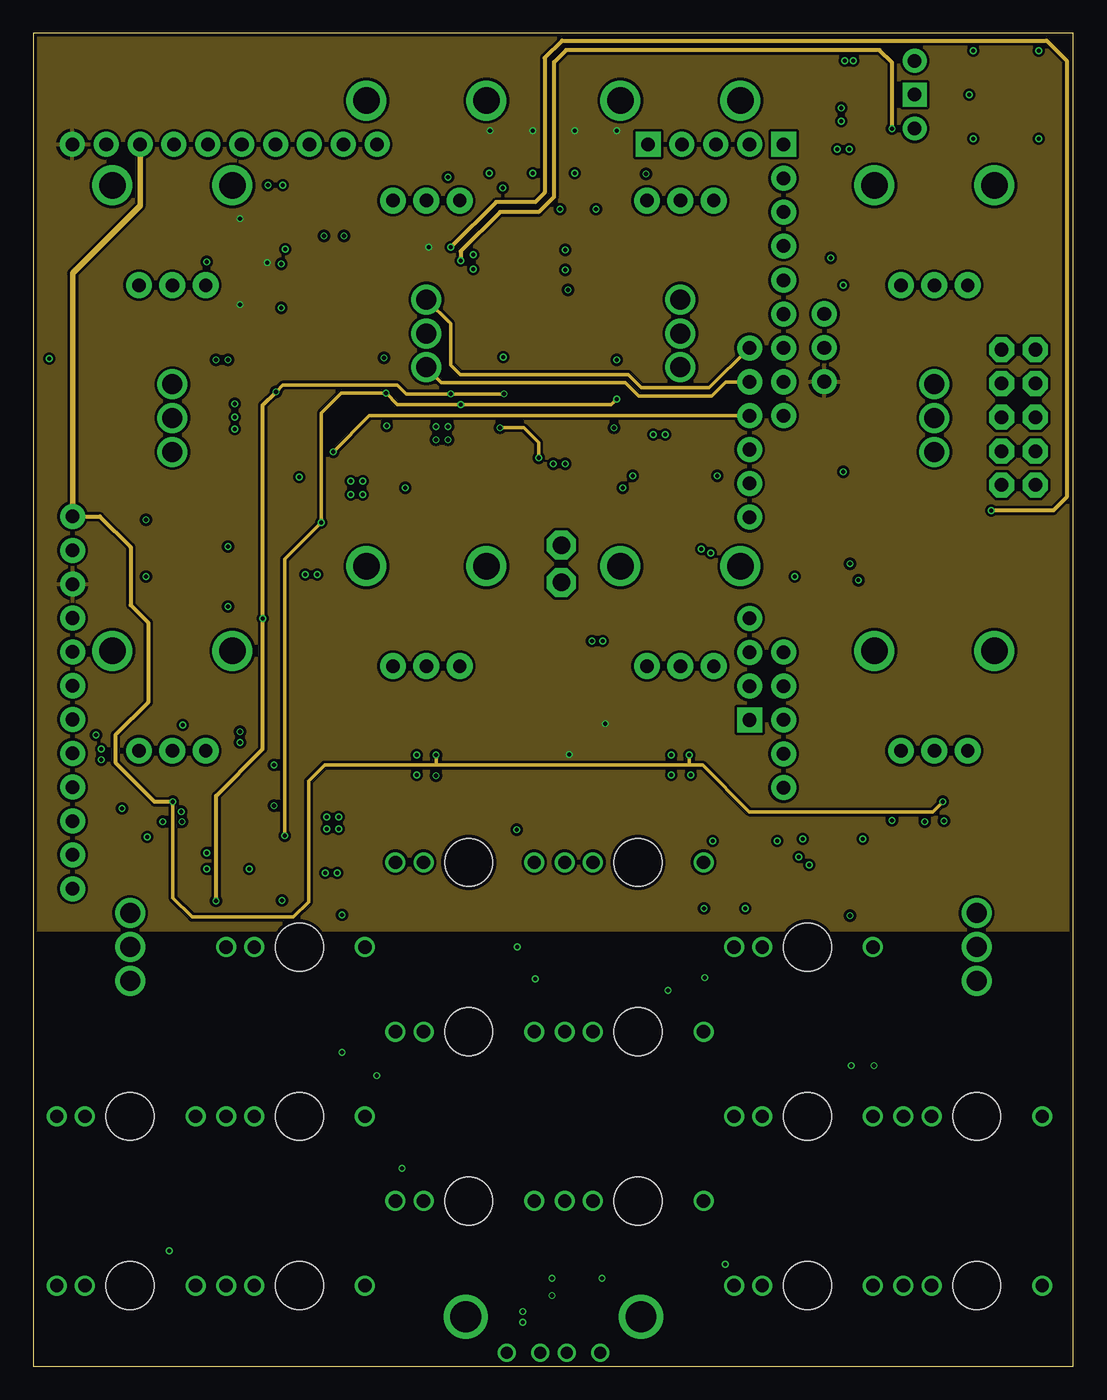
[diagram p4: board, inner layer InnerBottom]
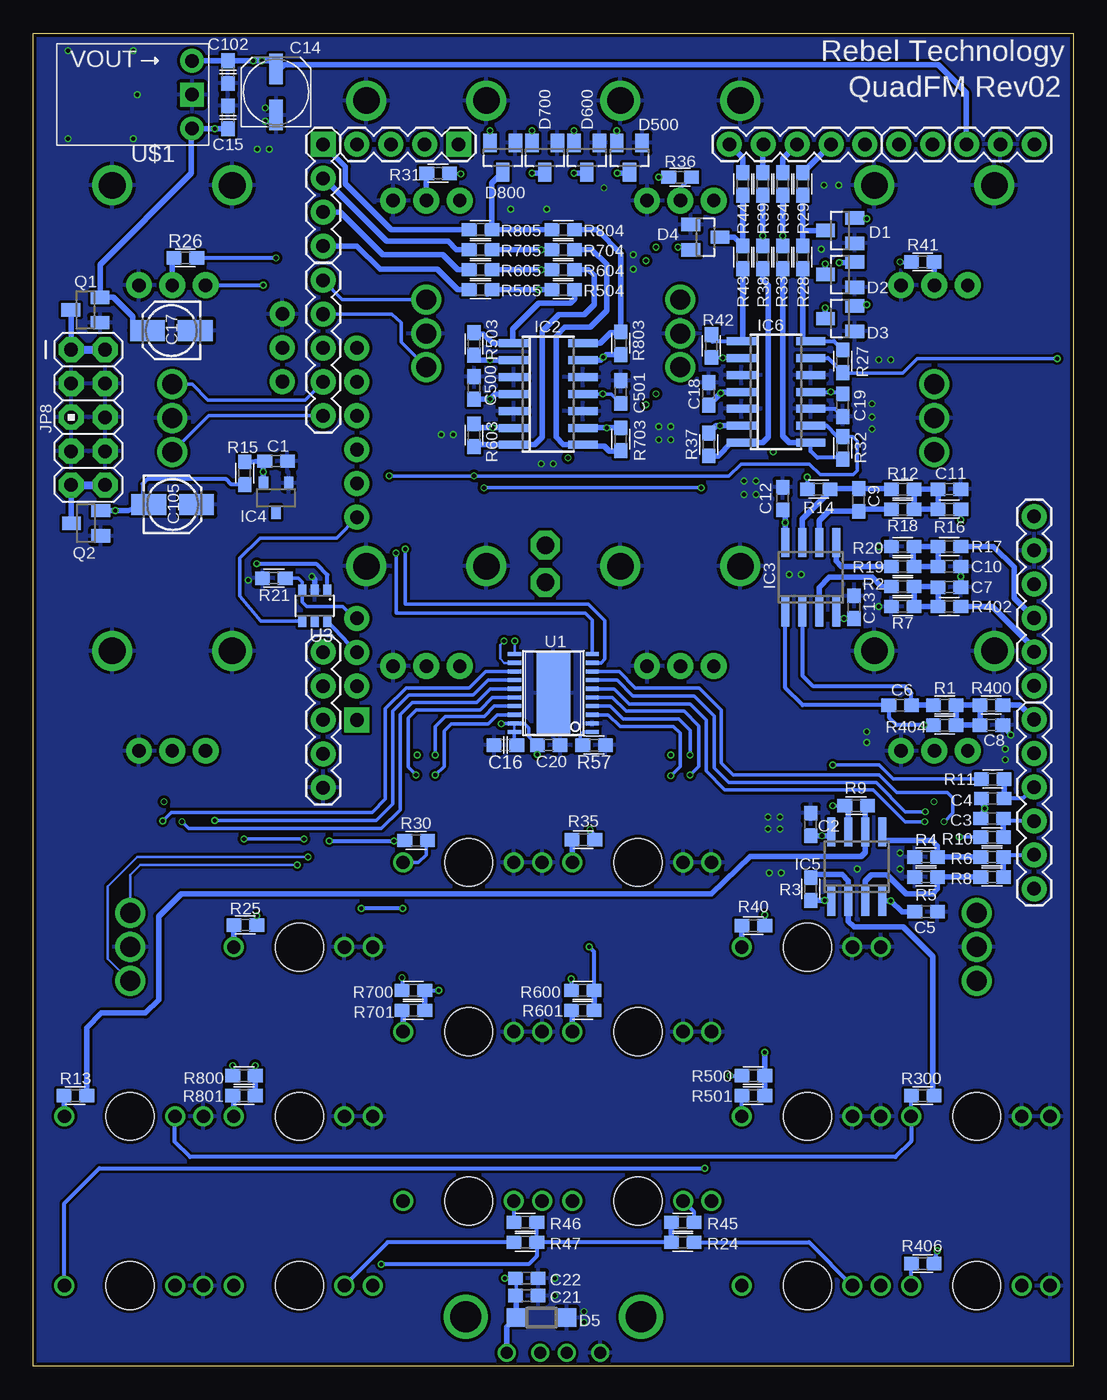
[diagram p5: board, bottom side, seen from below]

Size 78 x 100 mm. Coordinates in mm from the lower left corner, seen from the top.
Outline: 0,0 78,0 78,100 0,100 0,0
Copper layers (1*2*15*16): Top 0.035mm / dielectric 0.2mm / InnerTop 0.0175mm / dielectric 0.3mm / InnerBottom 0.0175mm / dielectric 0.2mm / Bottom 0.035mm
Design rules "SeeedStudio_4layer_DRU_no_angle_20140221": minimum track width 8mil, minimum drill 12mil, track to track 8mil, track to pad 8mil, pad to pad 8mil, via to via 8mil, smd to smd 0mil, copper to edge 10mil, drill to drill 8mil, minimum pad ring 6mil, minimum via ring 4mil, stop-mask expansion 4mil, vias tented up to drill 25mil, thermal gap 10mil

### Footprints (pad centres in the part's own frame; a part is rotated, then mirrored left to right if it is on the bottom)
1X04 = drill 1.016 pad 1.88 square: 1 0,0 | drill 1.016 pad 1.88: 2 2.54,0; 3 5.08,0; 4 7.62,0
1X06 = drill 1.016 pad 1.88: 1 0,0; 2 2.54,0; 3 5.08,0; 4 7.62,0; 5 10.16,0; 6 12.7,0
1X03 = drill 1.016 pad 1.88: 1 0,0; 2 2.54,0; 3 5.08,0
C0603 = smd 1.1 x 1: 1 -0.85,0; 2 0.85,0
CPOL-5 = smd 2.3 x 1: + 1.725,0; - -1.725,0
153CLV-0405 = smd 2.6 x 1.6: + 1.8,0; - -1.8,0
THONKICONN = drill 1: P$1 0,-5.5; P$2 0,-3.38; P$3 0,4.92 | hole 3.6: 0,0
SOT23 = smd 1 x 1.4: 1 -0.95,-1.1; 2 0.95,-1.1; 3 0,1.1
SOD123 = smd 1.4 x 1.4: A 1.9,0; C -1.9,0
SO14 = smd 0.6 x 2.2: 1 -3.81,-2.6; 2 -2.54,-2.6; 3 -1.27,-2.6; 4 0,-2.6; 5 1.27,-2.6; 6 2.54,-2.6; 7 3.81,-2.6; 8 3.81,2.6; 9 2.54,2.6; 10 1.27,2.6; 11 0,2.6; 12 -1.27,2.6; 13 -2.54,2.6; 14 -3.81,2.6
SO08 = smd 0.6 x 2.2: 1 -1.905,-2.6; 2 -0.635,-2.6; 3 0.635,-2.6; 4 1.905,-2.6; 5 1.905,2.6; 6 0.635,2.6; 7 -0.635,2.6; 8 -1.905,2.6
DBZ_R-PDSO-G3 = smd 0.7 x 1: 1 -0.95,-1.1; 2 0.95,-1.1; 3 0,1.1
AVR_ICSP = drill 1.016 pad 1.88 octagon: 1 -1.27,5.08; 2 1.27,5.08; 3 -1.27,2.54; 4 1.27,2.54; 5 -1.27,0; 6 1.27,0; 7 -1.27,-2.54; 8 1.27,-2.54; 9 -1.27,-5.08; 10 1.27,-5.08
RGB-LED-703-1028 = smd 0.7 x 1.4: P1 -0.75,1.65; P2 -0.75,-1.65; P3 0.75,-1.65; P4 0.75,1.65
1X05 = drill 1.016 pad 1.88: 1 0,0; 2 2.54,0; 3 5.08,0; 4 7.62,0; 5 10.16,0
1X02 = drill 1.016 pad 1.88: 1 0,0; 2 2.54,0
POT-ALPS-RK09L1140 = drill 1 pad 1.93: 1 -2.5,-7.5; 2 0,-7.5; 3 2.5,-7.5 | drill 2: P$5 -4.5,0; P$6 4.5,0
0603 = smd 1.1 x 1: 1 -0.85,0; 2 0.85,0
SUB-MIN-SPDT = drill 1.5: 1 0,-2.54; 2 0,0; 3 0,2.54
P1-13 = drill 1.321 pad 2.159 octagon: TP 0,0
TSSOP20-TE = smd 0.305 x 0.991: 1 -2.925,-2.918; 2 -2.275,-2.918; 3 -1.625,-2.918; 4 -0.975,-2.918; 5 -0.325,-2.918; 6 0.325,-2.918; 7 0.975,-2.918; 8 1.625,-2.918; 9 2.275,-2.918; 10 2.925,-2.918; 11 2.925,2.918; 12 2.275,2.918; 13 1.625,2.918; 14 0.975,2.918; 15 0.325,2.918; 16 -0.325,2.918; 17 -0.975,2.918; 18 -1.625,2.918; 19 -2.275,2.918; 20 -2.925,2.918 | smd 6.07 x 2.5: TE 0,0
SOT23-6 = smd 0.6 x 0.9: 1 -0.95,-1.15; 2 0,-1.15; 3 0.95,-1.15; 4 0.95,1.15; 5 0,1.15; 6 -0.95,1.15
REG_S9V11F5 = drill 1.016 pad 1.778 square: GND 0,0 | drill 1.016 pad 1.778: VIN -2.54,0; VOUT 2.54,0
KUSBVX = drill 0.9 pad 1.3: 1 3.5,0; 2 1,0; 3 -1,0; 4 -3.5,0 | drill 2.3 pad 2.8: M1 -6.57,2.71; M2 6.57,2.71

### Placement (x,y rotation side)
ADC  56.27,91.67 270 bottom
ANG1  2.94,63.75 270 bottom
ANG2  2.94,48.52 270 bottom
BOOT  59.32,78.95 270 top
C1  59.8,67.9 0 bottom
C2  19.7,40.65 90 bottom
C3  6.1,41.1 180 bottom
C4  6.05,42.6 180 bottom
C5  11.05,34.1 180 bottom
C6  13,49.6 180 bottom
C7  9.3,58.45 0 bottom
C8  6.15,48.1 0 bottom
C9  16.1,65 90 bottom
C10  9.3,60 0 bottom
C11  9.3,65.8 0 bottom
C12  21.8,65.1 90 bottom
C13  16.45,56.95 270 bottom
C14  59.8,95.6 90 bottom
C15  63.4,93.7 90 bottom
C16  42.6,46.6 0 bottom
C17  67.65,77.7 180 bottom
C18  27.35,72.95 90 bottom
C19  17.3,72.1 90 bottom
C20  39.35,46.6 0 bottom
C21  41,5.3 0 bottom
C22  41,6.6 0 bottom
C102  63.4,97.1 270 bottom
C105  67.55,64.65 0 bottom
C500  44.95,73.4 90 bottom
C501  33.95,73.1 270 bottom
CV_A  19.95,18.75 270 top
CV_B  32.65,25.1 270 top
CV_C  45.35,25.1 270 top
CV_D  58.05,18.75 270 top
D1  17.5,85.2 90 bottom
D2  17.5,81.9 90 bottom
D3  17.5,78.6 90 bottom
D4  27.6,84.7 270 bottom
D5  39.9,3.65 0 bottom
D500  33.29,90.68 180 bottom
D600  36.49,90.68 180 bottom
D700  39.64,90.68 180 bottom
D800  42.79,90.68 180 bottom
ENV_A  19.95,6.05 270 top
ENV_B  32.65,12.4 270 top
ENV_C  45.35,12.4 270 top
ENV_D  58.05,6.05 270 top
EXTSPI  46.11,91.67 180 bottom
IC2  39.38,72.94 270 bottom
IC3  19.7,59.2 0 bottom
IC4  59.8,65.15 180 bottom
IC5  16.24,37.48 0 bottom
IC6  22.3,73.1 270 bottom
IN_L  7.25,18.75 270 top
IN_R  70.75,18.75 270 top
JP8  73.89,71.19 0 bottom
JP12  53.73,63.69 90 top
LED1  10.43,41.61 90 top
LED2  29.48,45.11 90 top
LED3  48.52,45.11 90 top
LED4  67.58,41.61 90 top
LGP1-5  25.79,91.67 0 bottom
LGP6-7  10.55,91.67 180 bottom
MOD_A  10.43,53.67 0 top
MOD_B  29.48,60.02 0 top
MOD_C  48.52,60.02 0 top
MOD_D  67.58,53.67 0 top
OUT_L  7.25,6.05 270 top
OUT_R  70.75,6.05 270 top
PWR  8.01,91.67 0 bottom
Q1  74.1,79.25 90 bottom
Q2  74.05,63.25 90 bottom
R1  9.65,49.6 180 bottom
R2  12.8,58.5 180 bottom
R3  19.7,35.8 90 bottom
R4  11.05,38.2 0 bottom
R5  11.05,36.7 0 bottom
R6  6.1,38.2 0 bottom
R7  12.8,57 0 bottom
R8  6.1,36.7 0 bottom
R9  16.3,42.05 0 bottom
R10  6.1,39.7 180 bottom
R11  6.05,44.05 180 bottom
R12  12.8,65.8 180 bottom
R13  74.85,20.3 180 bottom
R14  19.1,65.8 180 bottom
R15  62.15,67 90 bottom
R16  9.3,64.3 180 bottom
R17  9.3,61.5 180 bottom
R18  12.8,64.3 180 bottom
R19  12.8,60 180 bottom
R20  12.8,61.5 0 bottom
R21  59.96,59.12 0 bottom
R24  29.3,9.3 180 bottom
R25  62.1,33.1 0 bottom
R26  66.6,83.15 0 bottom
R27  17.3,75.4 90 bottom
R28  20.3,83.2 270 bottom
R29  20.3,88.7 270 bottom
R30  49.3,39.45 180 bottom
R31  47.65,89.5 0 bottom
R32  17.3,68.9 270 bottom
R33  21.8,83.2 270 bottom
R34  21.8,88.7 270 bottom
R35  36.75,39.5 0 bottom
R36  29.5,89.2 180 bottom
R37  27.35,69.15 270 bottom
R38  23.3,83.2 270 bottom
R39  23.3,88.7 270 bottom
R40  24,33.05 0 bottom
R41  11.3,82.85 180 bottom
R42  27.15,76.55 90 bottom
R43  24.8,83.2 270 bottom
R44  24.8,88.7 270 bottom
R45  29.3,10.8 180 bottom
R46  41.1,10.8 0 bottom
R47  41.1,9.3 0 bottom
R57  35.95,46.6 180 bottom
R300  11.3,20.3 180 bottom
R400  6.15,49.6 180 bottom
R402  9.3,57 180 bottom
R404  9.65,48.1 180 bottom
R406  11.3,7.7 180 bottom
R500  24,21.8 0 bottom
R501  24,20.3 0 bottom
R503  44.95,76.7 90 bottom
R504  38.26,80.77 0 bottom
R505  44.46,80.77 0 bottom
R600  36.8,28.2 0 bottom
R601  36.8,26.7 0 bottom
R603  44.95,69.85 270 bottom
R604  38.26,82.27 0 bottom
R605  44.46,82.27 0 bottom
R700  49.5,28.2 0 bottom
R701  49.5,26.7 0 bottom
R703  33.95,69.55 270 bottom
R704  38.26,83.77 0 bottom
R705  44.46,83.77 0 bottom
R800  62.2,21.8 0 bottom
R801  62.2,20.3 0 bottom
R803  33.95,76.75 90 bottom
R804  38.26,85.27 0 bottom
R805  44.46,85.27 0 bottom
SW1  10.43,71.14 0 top
SW2  29.48,77.49 0 top
SW3  48.52,77.49 180 top
SW4  67.58,71.14 0 top
SW5  70.75,31.45 0 top
SW6  7.25,31.45 180 top
TGP1-4  56.27,71.31 90 bottom
TP1  39.6,61.6 0 top
TP2  39.6,58.8 0 top
TUNE_A  10.43,88.6 0 top
TUNE_B  29.48,94.95 0 top
TUNE_C  48.52,94.95 0 top
TUNE_D  67.58,88.6 0 top
TUNEIN_A  19.95,31.45 270 top
TUNEIN_B  32.65,37.8 270 top
TUNEIN_C  45.35,37.8 270 top
TUNEIN_D  58.05,31.45 270 top
U1  39,50.5 90 bottom
U3  56.9,57.05 180 bottom
U$1  66.1,95.4 90 bottom
USB_D  56.27,53.57 270 bottom
USB_H  53.73,48.48 90 top
X3  39,1 0 top

### Tracks (layer width: path | path; a pad name or v marks a point on that pad's centre or on a via)
+3V3  (via drill 0.3)
  Bottom 0.205: U1.20 U1.19
  Bottom 0.254: v42.9,48.2 42.88,48.23 U1.19 41.17,48.23 40.85,47.9 40.85,47.25 C20.1 v40.2,45.9 | v29.65,83.95 28.9,83.95 D4.2 | U1.20 41.92,46.77
  Bottom 0.305: v34.25,92.7 D500.2 | v37.45,92.7 D600.2 | v40.6,92.7 D700.2 | v43.75,92.7 D800.2
  Bottom 0.406: v15.5,86.1 16.35,86.1 D1.2 | v17.55,82.8 16.35,82.8 D2.2 | v15.5,79.65 D3.2 | C16.2 41.92,46.6 41.92,46.77
  pour InnerBottom: -1.25,32.75 -1.7,100.45 79.3,100.45 79.25,32.75
+5V  (via drill 0.3)
  Top 0.254: LED3.P3 49.41,45.86 v49.2,45.85 | LED1.P3 v10.46,42.36 v10.45,42.35 | v68.2,42.35 69.22,42.35 LED4.P3 | v30.2,45.85 LED2.P3
  Top 0.305: v61.5,97.95 60.4,97.95 59.45,97 59.45,84.65 62.3,81.8 62.3,66.25 61.25,65.2 v61.25,60.2
  InnerBottom 0.254: 30.2,45.1 21.85,45.1 20.65,43.9 20.65,34.85 19.5,33.7 11.9,33.7 10.46,35.14 v10.46,42.34 arc90 v10.45,42.35 | 30.2,45.1 49.2,45.1 | 49.2,45.1 v49.2,45.85 | v30.2,45.85 30.2,45.1 | 49.2,45.1 50.2,45.1 53.7,41.6 67.45,41.6 v68.2,42.35
  InnerBottom 0.305: ANG1.1 4.99,63.76 7.3,61.45 7.3,57.1 8.6,55.8 8.6,49.8 6.15,47.35 6.15,45.3 9.1,42.35 v10.45,42.35
  InnerBottom 0.406: PWR.1 8.01,87.06 2.95,82 ANG1.1
  Bottom 0.305: v61.25,60.2 56.78,60.2 55.95,59.37 U3.1
  Bottom 0.406: U$1.VOUT C102.1 v61.5,97.95 v60.85,97.95 60.1,97.95 C14.+ 59.48,97.33 59.15,97.65 10.15,97.65 8.05,95.55 8.05,91.71 PWR.1 | U$1.VOUT 66.25,97.95 | U$1.VOUT
+12V  (via drill 0.3)
  Top 0.305: v32.05,72.15 v32.05,82.95
  InnerBottom 0.254: v18.85,39.8 18.85,60.55 v21.6,63.3 21.6,71.5 23.1,73 v26.45,73 27.3,72.15 v32.05,72.15 43.35,72.15 v43.75,72.55
  InnerBottom 0.305: v64.4,92.85 64.4,97.8 63.45,98.75 39.95,98.75 39.05,97.85 39.05,87.75 37.9,86.6 35,86.6 32.05,83.65 v32.05,82.95
  Bottom 0.406: C12.1 21.6,64.05 | IC3.8 21.61,62.35 21.6,64.05 | v21.6,63.3 21.6,64.05 | 45,72.25 C500.1 v43.75,72.55 43.36,72.94 IC2.4 | 18.1,40.7 18.1,40.12 IC5.8 18.43,39.8 v18.85,39.8 C2.1 | IC6.4 26.35,73.1 v26.45,73 C18.1 | C15.1 v64.4,92.85 U$1.VIN | C17.+ 70.55,77.7 70.55,78.75 72,80.2 Q1.2 73,82.65 66.15,89.5 66.15,92.85 U$1.VIN | U$1.VIN
-12V  (via drill 0.3)
  Top 0.305: v31.3,72.95 v31.3,83.95
  InnerBottom 0.254: v35.3,72.95 v31.3,72.95 27.95,72.95 27.3,73.6 18.7,73.6 v18.2,73.1
  InnerBottom 0.305: v13.7,34.9 13.7,42.8 17.2,46.3 v17.2,56.1 17.2,72.1 v18.2,73.1 | v71.85,64.2 76.5,64.2 77.5,65.2 77.5,97.95 76,99.45 39.65,99.45 38.35,98.15 38.35,88.05 37.65,87.35 34.7,87.35 v31.3,83.95
  Bottom 0.254: 17.45,73.1 C19.2 | IC2.11 v35.29,72.94 | C501.2 34.64,72.94 v35.29,72.94 | v35.29,72.94 v35.3,72.95
  Bottom 0.305: IC6.11 v18.2,73.1 17.45,73.1 | R15.1 63.15,66.15 63.55,66.55 69.45,66.55 69.8,66.2 69.8,65.3 C105.-
  Bottom 0.406: 14.4,35.7 14.4,34.95 arc-90 IC5.4 14.31,34.9 v13.7,34.9 12.85,34.1 C5.2 | C13.2 v17.2,56.1 17.75,56.1 17.9,55.95 17.9,56.49 IC3.4 | Q2.2 v71.85,64.2 70.9,64.2 C105.-
ADC1
  Bottom 0.406: R505.1 46.17,80.77 47.7,82.3 52,82.3 53.75,84.05 ADC.4
ADC2
  Bottom 0.406: R605.1 46.17,82.27 47.3,83.4 51.8,83.4 55,86.6 56.09,86.59 ADC.3
ADC3
  Bottom 0.406: ADC.2 56.24,89.1 56.2,89.1 51.5,84.4 46.9,84.4 46.27,83.77 R705.1
ADC4
  Bottom 0.406: R805.1 51.17,85.27 54.6,88.7 54.6,90 ADC.1
AIN_A
  Bottom 0.305: ANG2.4 5.05,40.9 C3.1
  Bottom 0.406: C3.1 R10.1
AIN_B
  Bottom 0.305: ANG2.3 2.96,43.44 3.8,42.6 C4.1
  Bottom 0.406: C4.1 R11.1
AOUT_A+
  Bottom 0.406: ANG1.5 2.94,53.84 6.1,57 R402.1
AOUT_A-
  Bottom 0.406: R400.1 4.02,49.6 ANG2.1
AOUT_B+
  Bottom 0.406: R17.1 6,61.5 4.45,59.95 4.45,57.64 ANG1.4
AOUT_B-  (via drill 0.3)
  Top 0.305: ANG1.6 7.96,51.06 9.25,52.35 9.25,62.7 v8.45,63.5
  Bottom 0.305: v8.45,63.5 R16.1
BOOT0
  Top 0.406: TGP1-4.3 59.45,76.39 BOOT.2
CS_VREF  (via drill 0.3)
  Top 0.305: v6.65,41.85 6.65,39.9 5.11,38.36 ANG2.5
  Bottom 0.305: R6.2 5.25,38.22 5.11,38.36 ANG2.5
  Bottom 0.406: C3.2 v6.65,41.85 C4.2 | R8.2 R6.2
CV_REF  (via drill 0.3)
  Top 0.305: TUNE_A.1 7.9,81.12 7.9,83.35 9.2,84.65 15.85,84.65 18.65,87.45 TUNE_B.1 26.98,89.38 28.1,90.5 41.85,90.5 | 41.85,90.5 42.98,90.5 TUNE_C.1 | 41.85,90.5 41.75,90.6 41.75,96.15 42.9,97.3 56.4,97.3 58.1,95.6 58.1,83.75 v60.75,81.1 v60.75,67.1 59.8,66.15 59.8,36.8 58.85,35.85 55.8,32.75 55.8,11.55 v51.9,7.65
  Bottom 0.305: 60.75,67.85 C1.1 | R47.2 R46.2 | R24.2 R45.2 | 30.45,9.3 R47.2 | TUNE_D.1 v60.75,81.1 | R47.2 40.25,8.25 40.85,7.65 v51.9,7.65
  Bottom 0.406: 60.55,67.75 arc90 C1.1 R15.2 | 60.75,67.85 v60.75,67.1 IC4.2 | R45.2 30.15,9.6 30.45,9.3
EXTSPI_CLK  (via drill 0.3)
  Top 0.254: EXTSPI.3 53.35,89.45 53.35,78.25 52.4,77.3 52.4,62.6 v50.8,61
  Bottom 0.254: U1.10 36.08,55.98 36.6,56.5 50.8,56.5 v50.8,61
EXTSPI_MOSI  (via drill 0.3)
  Top 0.254: EXTSPI.1 47.73,90.05 51.7,90.05 52.85,88.9 52.85,78.45 51.9,77.5 51.9,63.1 v50.1,61.3
  Bottom 0.254: U1.9 35.42,52.77 35.15,53.05 35.15,55.95 36.4,57.2 50.1,57.2 v50.1,61.3
GND  (via drill 0.3)
  Top 0.406: v8.45,59.25 4.9,59.25 ANG1.2
  Bottom 0.305: IC6.10 17.88,71.83 C19.1
  Bottom 0.406: C10.2 v8.45,59.25 C7.2 | C8.2 v4.7,47.35 | U3.2 56.9,59.03 v57.1,59.24
  other vias: 14.6,61.5 14.6,57 15.1,71.2 15.1,72.2 15.1,70.3 23.8,66.4 24.7,66.4 21.9,37 22.8,37 16.2,37.3 22,40.3 22.9,40.3 22,41.2 22.9,41.2 20.4,59.4 21.3,59.4 13,37.3 13,38.5 31.1,70.5 30.2,70.5 42.2,86.8 39.5,86.8 35.2,88.4 33,83.4 33,82.3 18.9,83.8 13.7,75.5 14.6,75.5 46.5,69.9 47.4,69.9 30.2,69.5 31.1,69.5 60.3,91.3 61.2,91.3 70.5,98.7 75.4,98.7 75.4,92.1 70.5,92.1 70.2,95.4 60.6,94.4 60.6,93.4 39.9,67.7 39,67.7 17.6,88.6 18.7,88.6 23.8,65.4 24.7,65.4 5.1,45.5 5.1,46.3 38.9,6.6 38.9,5.3 36.7,4.1 36.7,3.3 15.5,47.6 15.5,46.8 61.88,58.97
  pour Bottom: -1.1,0 -1.5,100.5 79.5,100.5 79.5,0
  pour InnerTop: -1.1,-0.05 -1.5,100.45 79.5,100.45 79.5,-0.05
GP1_ADC5
  Bottom 0.406: R44.1 24.8,90.68 LGP1-5.1
GP2_ADC6
  Bottom 0.406: R39.1 23.3,91.62 LGP1-5.2
GP3_ADC7
  Bottom 0.406: R34.1 21.8,90.58 LGP1-5.3
GP4_ADC8
  Bottom 0.406: R29.1 20.29,89.55 LGP1-5.4
GP5_SW1L
  Top 0.254: 15.1,91.6 15.56,91.6 LGP1-5.5 15.17,91.67 6.3,82.8 6.3,75.3 7.9,73.7 10.4,73.7 SW1.3
GP6_SW6_L
  Top 0.254: SW6.1 2.71,33.99 1.5,35.2 1.5,64.4 5.8,68.7 5.8,83.06 13.1,90.36 LGP6-7.2
GP7_SW6_H
  Top 0.254: SW6.3 7.19,28.91 5.6,30.5 5.6,32.6 4.8,33.4 2.5,33.4 1,34.9 1,64.6 5.3,68.9 5.3,83.3 10.55,88.55 LGP6-7.1
GP8_SW3L
  Bottom 0.254: SW3.1 54.83,80.03 TGP1-4.5
GP9_SW3H
  Bottom 0.254: TGP1-4.4 51.13,78.93 50.4,78.3 50.4,76.82 SW3.3
GP10_SW4L
  Bottom 0.254: TGP1-4.2 57.62,72.5 64.9,72.5 66.08,73.68 SW4.3
GP11_SW4H
  Bottom 0.254: TGP1-4.1 64.86,71.31 SW4.1
GP16_SW2L
  InnerBottom 0.254: JP12.6 53.69,76.39 50.7,73.4 45.6,73.4 44.6,74.4 32,74.4 31.3,75.1 31.3,78.2 SW2.3
GP17_SW2H
  InnerBottom 0.254: SW2.1 29.45,74.95 30.6,73.8 44.4,73.8 45.4,72.8 50.88,72.8 51.93,73.85 JP12.5
GP18_SW1H  (via drill 0.3)
  Top 0.254: v22.5,68.6 SW1.1
  InnerBottom 0.254: JP12.4 25.21,71.31 v22.5,68.6
GP19_SW5L  (via drill 0.3)
  Top 0.204: JP12.3 56.53,68.77 59.2,66.1 59.2,38.6 v58.2,37.6
  Bottom 0.204: v58.2,37.6 70,37.6 70.75,36.85 SW5.3
GP20_SW5H  (via drill 0.3)
  Top 0.204: JP12.2 56.07,66.23 57.7,64.6 58.7,63.6 58.7,39.5 v57.4,38.2 57.7,38.5
  Bottom 0.204: v57.4,38.2 70.2,38.2 72.4,36 72.4,30.56 SW5.1
GP21_USB_FAULT
  Bottom 0.254: JP12.1 53.71,63.69 55.25,62.15 61,62.15 62.52,60.63 62.52,57.78 60.95,55.9 U3.4
IN_L
  Bottom 0.305: 12.17,20.28 IN_L.P$3 12.17,16.88 13.35,15.7 66.25,15.7 67.4,16.85 67.4,18.72
  Bottom 0.406: 12.17,20.28 R300.2 | 67.4,18.72 IN_R.P$2
IN_R
  Bottom 0.406: IN_R.P$3 75.67,20.27 R13.2
LEDA_B  (via drill 0.3)
  Top 0.254: v9.7,40.85 LED1.P1
  Bottom 0.254: U1.8 34.08,52.12 32.85,50.9 28.05,50.9 26.4,49.25 26.4,45.25 25.5,44.35 14.55,44.35 13.25,43.05 9.45,43.05 9.05,42.65 9.05,41.5 v9.7,40.85
LEDA_G  (via drill 0.3)
  Top 0.254: LED1.P4 9.54,41.6 v11.1,41.6
  Bottom 0.254: U1.7 34.23,51.48 33.05,50.3 28.45,50.3 26.95,48.8 26.95,44.9 25.85,43.8 14.8,43.8 12.6,41.6 v11.1,41.6
LEDA_R  (via drill 0.3)
  Top 0.254: v11.15,40.85 v11.16,40.86 LED1.P2
  Bottom 0.254: U1.6 34.42,50.83 33.3,49.7 28.75,49.7 27.55,48.5 27.55,44.65 26.15,43.25 15,43.25 12.6,40.85 v11.15,40.85
LEDB_B  (via drill 0.3)
  Top 0.254: v28.75,44.35 LED2.P1
  Bottom 0.254: U1.5 34.58,50.17 33.55,49.15 29.2,49.15 28.1,48.05 28.1,45 v28.75,44.35
LEDB_G  (via drill 0.3)
  Top 0.254: v28.75,45.85 LED2.P4
  Bottom 0.254: U1.4 34.73,49.52 33.75,48.55 29.6,48.55 28.75,47.7 v28.75,45.85
LEDB_R  (via drill 0.3)
  Top 0.254: v30.2,44.3 30.26,44.36 LED2.P2
  Bottom 0.254: U1.3 34.88,48.88 34,48 30,48 29.5,47.5 29.5,45 v30.2,44.3
LEDC_B  (via drill 0.3)
  Top 0.254: v47.85,44.35 LED3.P1
  Bottom 0.254: U1.18 43.23,48.88 43.9,48.2 46.65,48.2 47.2,47.65 47.2,45 v47.85,44.35
LEDC_G  (via drill 0.3)
  Top 0.254: v47.85,45.85 LED3.P4
  Bottom 0.254: 47.8,45.9 v47.85,45.85 47.85,48 47.1,48.75 44.2,48.75 43.42,49.52 U1.17
LEDC_R  (via drill 0.3)
  Top 0.254: v49.3,44.35 v49.31,44.36 LED3.P2
  Bottom 0.254: U1.16 43.58,50.17 44.5,49.25 49.3,49.25 49.9,48.65 49.9,44.95 v49.3,44.35
LEDD_B  (via drill 0.3)
  Top 0.254: v66.85,40.85 65.94,40.85 LED4.P1
  Bottom 0.254: v66.85,40.85 66.35,40.35 51.9,40.35 50.5,41.75 50.5,48.9 49.6,49.8 44.75,49.8 43.73,50.83 U1.15
LEDD_G  (via drill 0.3)
  Top 0.254: 65.94,42.35 LED4.P4 64.75,42.35 64.4,42 v64.4,40.95
  Bottom 0.254: U1.14 43.88,51.48 45,50.35 49.85,50.35 51.05,49.15 51.05,42.2 52.3,40.95 v64.4,40.95
LEDD_R  (via drill 0.3)
  Top 0.254: v68.3,40.9 69.19,40.9 LED4.P2
  Bottom 0.254: U1.13 44.08,52.12 45.3,50.9 50.05,50.9 51.6,49.35 51.6,42.55 52.6,41.55 67.65,41.55 v68.3,40.9
N$1  (via drill 0.3)
  InnerTop 0.254: v8.55,39.7 16.5,39.7 18.65,37.55 v18.65,34.95
  Bottom 0.254: 7,39.7 v8.55,39.7
  Bottom 0.406: R10.2 7,39.7 | IC5.1 18.21,34.95 v18.65,34.95 R3.1
N$2
  Bottom 0.406: IC5.3 15.61,36.4 15.15,36.85 13.95,36.85 12.55,35.45 10.55,35.45 10.2,35.8 R5.2 R8.1
N$3
  Bottom 0.305: CV_A.P$3 24.87,20.28
  Bottom 0.406: 24.87,20.28 R501.1
N$4
  Bottom 0.406: 14.34,39.28 arc-90 14.3,39.25 14.1,39.45 | R6.1 R4.2 10.2,39.05 10.6,39.45 14.1,39.45 | IC5.5 14.34,39.69 14.1,39.45
N$5
  Bottom 0.406: 15.61,42.3 R9.2 15.61,41.9 IC5.6 15.61,38.55 15.9,38.25 24.25,38.25 27.15,35.45 66.9,35.45 68.6,33.75 68.6,27.5 69.6,26.5 72.9,26.5 74,25.4 R13.1
N$6  (via drill 0.3)
  Top 0.305: v47.6,28.2 47.6,39.2 44.35,42.45 39.05,42.45 37.9,43.6 v37.9,68.15
  InnerBottom 0.254: v37.9,68.15 37.9,69.28 IC2.9 v35,70.4
  Bottom 0.305: R700.2 v47.6,28.2
  Bottom 0.406: IC2.9 v35,70.4 R703.1 33.8,70.5 | R701.2 R700.2
N$7
  Bottom 0.305: C6.1 12.15,50.5 12.65,51 19.5,51 20.3,51.8 20.3,56.56 IC3.2
  Bottom 0.406: 10.5,49.65 R1.2 C6.1
N$8
  Bottom 0.406: Q2.3 JP8.9
  Bottom 0.61: JP8.9 JP8.10
N$9
  Bottom 0.406: R3.2 19.3,36.9 17.35,36.9 16.88,36.42 IC5.2 16.88,33.38 16.45,32.95 12.75,32.95 10.55,30.75 10.55,20.4 R300.1
N$10  (via drill 0.3)
  Top 0.254: v18.05,45.1 v18.05,42.05
  Bottom 0.254: R11.2 9.1,44.05 13.5,44.05 14.55,45.1 v18.05,45.1 | v18.05,42.05 R9.1
  Bottom 0.406: 16.88,41.98 R9.1 16.88,41.77 IC5.7
N$11
  Bottom 0.406: R2.2 14.4,58.5 15.1,59.2 18.3,59.2 19.07,58.44 IC3.3
N$12
  Bottom 0.406: JP8.1 75.16,79.21 Q1.3
  Bottom 0.61: JP8.1 JP8.2
N$13  (via drill 0.3)
  Top 0.254: v44.2,65.9 44.2,67.05 44.6,67.45 44.6,74.65 v43.75,75.5
  Top 0.305: v23.15,23.55 23.15,32.6 25.6,35.05 25.6,53.25 27.9,55.55 v27.9,65.9
  Bottom 0.254: v43.75,75.5 44.75,75.5 R503.1 | v27.9,65.9 v44.2,65.9
  Bottom 0.406: IC2.2 44.93,75.48 R503.1 | R501.2 R500.2 v23.15,23.55
N$14  (via drill 0.3)
  Top 0.305: v25.75,21.8 13.8,21.8 12.7,22.9 12.6,34.85 14.3,36.55 14.4,43.4 13.3,44.5 10.95,44.5 10.45,45 MOD_A.2
  Bottom 0.305: v25.75,21.8 R500.1
N$15
  Bottom 0.406: R7.2 R2.1 10.2,58.5 C7.1 R402.2 | 12,57 R7.2 | R7.2 10.25,57
N$16  (via drill 0.3)
  Top 0.406: v34.2,89.5 34.2,84.55 38,80.75 v40.1,80.75
  Bottom 0.406: 43.96,80.42 arc90 R505.2 40.1,80.77 | 40.1,80.77 R504.1 39.88,80.77 | v34.2,89.5 33.37,89.5 D500.3 | v40.1,80.75 40.1,80.77
N$17
  Bottom 0.406: IC2.1 43.55,76.75 44.25,77.45 44.9,77.45 R503.2 | 41.55,76.75 IC2.1 | R504.2 37.41,80.09 37.75,79.75 40.1,79.75 42.05,77.8 42.05,76.82 IC2.1
N$18
  Bottom 0.406: R12.2 13.7,65.85 C9.2 18.05,65.85 18.25,65.65 | IC3.7 20.34,63.56 18.25,65.65 | R14.1 18.25,65.65
N$19
  Bottom 0.406: CV_B.P$3 37.57,26.62 R601.1
N$20  (via drill 0.3)
  Top 0.305: v36.3,31.45 36.3,38.85 37.2,39.75 37.2,68.5 39.1,70.4 v43.55,70.4
  Bottom 0.305: R600.2 35.95,31.1 v36.3,31.45
  Bottom 0.406: R600.2 R601.2 | IC2.6 v43.55,70.4 44.45,70.4 R603.1
N$21  (via drill 0.3)
  Top 0.305: MOD_B.2 29.48,50.08 30.35,49.2 33.85,49.2 35.6,47.45 35.6,31.1 v37.65,29.05
  Bottom 0.305: v37.65,29.05 R600.1
N$22
  Bottom 0.406: 41.96,69.15 IC2.7 | IC2.7 44.42,69.13 R603.2 | R604.2 36.37,82.27 35.95,81.85 35.95,79.65 36.7,78.9 38.6,78.9 39.85,77.65 39.85,69.7 40.4,69.15 41.25,69.15 41.3,69.2 41.91,69.2 IC2.7
N$23  (via drill 0.3)
  Top 0.406: v37.45,89.5 37.45,83.1 38.3,82.25 v39.9,82.25
  Bottom 0.406: R605.2 R604.1 39.88,82.27 v39.9,82.25 | v37.45,89.5 36.57,89.5 D600.3
N$24
  Bottom 0.406: C11.1 R16.2 R18.1 R12.1 10.2,65.8
N$25
  Bottom 0.406: CV_C.P$3 50.27,26.62 R701.1
N$26
  Bottom 0.406: IC3.6 19.07,63.44 18.35,64.15 C9.1 arc90 15.95,64.3 R18.2
N$27  (via drill 0.3)
  Top 0.305: MOD_C.2 48.52,50.83 45.65,47.95 45.65,43.25 49,39.9 49,30.5 v50.35,29.15
  Bottom 0.305: v50.35,29.15 R700.1
N$28
  Bottom 0.305: IC2.8 arc-90 36.7,69.05 | 34,68.65 R703.2
  Bottom 0.406: R704.2 36.12,83.77 35,82.7 35,79.2 36.25,77.95 38.15,77.95 38.8,77.3 38.8,69.7 38.25,69.15 36.8,69.15 IC2.8 | 36.7,69.05 35.2,69.05 34.8,68.65 34,68.65
N$29  (via drill 0.3)
  Top 0.406: v40.6,89.5 40.6,84.45 v39.9,83.75
  Bottom 0.406: R705.2 R704.1 39.88,83.77 arc-90 v39.9,83.75 | v40.6,89.5 39.72,89.5 D700.3
N$30
  Bottom 0.406: R19.2 17.4,60 17.8,60.4 17.8,60.8 | 17.8,61 17.7,61 17.7,60.9 17.8,60.8 | 17.8,60.8 IC3.5
N$31
  Bottom 0.406: CV_D.P$3 62.97,20.22 R801.1
N$32
  Bottom 0.406: R20.2 R17.2 C10.1 R19.1 11.95,60.15 12,60.2 | 12,60 12,60.2 | 12,60.2 12,61.5
N$33  (via drill 0.3)
  Top 0.254: v61.35,22.55 61.35,32.3 62.2,33.15 v62.2,39.55 | v35.25,75.7 35.23,75.72 35.9,76.4 44.45,76.4 45.55,75.3 45.55,62.45 50,58 57.1,58 58.2,56.9 58.2,40.05 v57.7,39.55
  Bottom 0.254: R800.2 v61.35,22.55 | v62.2,39.55 v57.7,39.55
  Bottom 0.406: R801.2 R800.2 | R803.1 35.05,75.9 v35.25,75.7 35.45,75.5 36.76,75.5 IC2.13
N$34  (via drill 0.3)
  Top 0.254: MOD_D.2 67.58,46.23 66.2,47.6 64.15,47.6 63.05,46.5 63.05,39.5 64.1,38.45 64.1,23.6 v63.05,22.55
  Bottom 0.254: v63.05,22.55 R800.1
N$35
  Bottom 0.406: R804.2 35.72,85.27 33.95,83.45 R803.2 34,77.55 34.7,77.55 35.5,76.75 IC2.14
N$36
  Bottom 0.406: R804.1 R805.2 43.61,88.76 D800.3
N$38
  Bottom 0.305: R24.1 19.82,9.3 ENV_A.P$2
N$39  (via drill 0.3)
  Top 0.305: v11.2,48.1 6.9,48.1 6.15,47.35 6.15,45.3 7.45,44 7.45,36.45 8.9,35 8.9,22.95 10.2,21.65 v10.2,8.65
  Bottom 0.305: IC3.1 21.6,50.9 20.3,49.6 C6.2 13.8,49.55 13.8,48.65 13.25,48.1 v11.2,48.1 R404.2 | R406.1 v10.2,8.65
  Bottom 0.406: 21.6,56.49 IC3.1
N$40  (via drill 0.3)
  Top 0.205: v42.7,54.4 42.7,58.5 TP1.TP
  Bottom 0.205: U1.12 42.67,52.77 43,53.1 43,54.1 v42.7,54.4
N$41
  Bottom 0.406: R400.2 C8.1 7.1,48.2 7.1,48.1 R404.1 R1.1 | 8.85,49.6 R1.1 | 7.05,49.6 R1.1
N$42  (via drill 0.3)
  Top 0.205: v41.9,54.4 41.9,56.5 TP2.TP
  Bottom 0.205: v41.9,54.4 41.9,53.44 U1.11
N$44
  Top 0.305: MOD_A.1 7.93,44.88 9,43.8 13,43.8 13.7,43.1 13.7,36.85 12,35.15 12,22.85 10.8,21.65 10.8,11.25 12.8,9.25 21.67,9.25 ENV_A.P$3
N$45
  Bottom 0.406: TUNEIN_D.P$3 62.97,33.08 R25.1
N$46
  Bottom 0.254: U1.1 36.77,47.58 37,47.35 37,46.8 R57.2
N$47  (via drill 0.3)
  Top 0.305: v1.2,75.6 0.95,75.95 0.95,94.7 4.2,97.95 56.65,97.95 58.75,95.85 58.75,84.2 v59.8,83.15 59.9,83.05 61.45,81.5 61.45,66.6 60.5,65.65 60.5,34.55 v61.25,33.8
  Bottom 0.254: 18.39,75.64 18.39,75.59 17.3,74.5 12.8,74.5 11.7,75.6 v1.2,75.6
  Bottom 0.305: IC6.13 18.39,75.64 | 18.39,75.64 R27.1 | 18.39,75.64 18.4,75.65 | R26.2 v59.8,83.15 | v61.25,33.8 R25.2
N$48
  Bottom 0.406: TUNE_D.2 67.58,83.03 R26.1
N$49
  Bottom 0.305: IC6.14 17.96,76.91 R27.2
  Bottom 0.406: R28.2 20.3,77 20.4,76.9 IC6.14
N$50
  Bottom 0.406: R29.2 20.3,85.2 | 20.3,85.2 R28.1 | D1.3 20.3,85.2
N$51
  Bottom 0.254: R30.1 48.55,39.4 48.55,38.35 49.15,37.8 TUNEIN_C.P$3
N$52  (via drill 0.3)
  Top 0.254: v45.95,89.45 51.45,89.45 52.35,88.55 52.35,78.65 51.3,77.6 v51.3,66.8
  Top 0.305: v44.95,66.8 44.95,62.25 49.8,57.4 56.7,57.4 57.6,56.5 57.6,41.2 v55.8,39.4
  Bottom 0.254: v45.95,89.45 46.75,89.45 R31.2 | v50.95,39.4 R30.2 | R32.1 16.55,69.75 16.2,69.4 16.2,67.2 16.5,66.9 19,66.9 19.8,67.7 24.9,67.7 25.85,66.8 v44.95,66.8 v51.3,66.8
  Bottom 0.305: R32.1 17.7,69.75 18.51,70.56 IC6.9 | v55.8,39.4 v50.95,39.4
N$53
  Bottom 0.406: TUNE_C.2 48.52,89.47 R31.1
N$54
  Bottom 0.305: R32.2 17.4,68.15 19.2,68.15 19.7,68.65 IC6.8
  Bottom 0.406: R33.2 21.8,69.8 21.3,69.3 IC6.8
N$55  (via drill 0.3)
  Top 0.406: v18.6,82.7 19.7,82.7 v21.8,84.8
  Bottom 0.406: R34.2 v21.8,84.8 R33.1 | D2.3 v18.6,82.7
N$56
  Bottom 0.406: TUNEIN_B.P$3 37.57,39.47 R35.1
N$57  (via drill 0.3)
  Top 0.305: 27.2,70.55 27.15,85.05 27.95,85.85 32.7,85.85 33.5,86.65 33.5,88.55 32.85,89.2 v31.1,89.2 | v36.25,40.25 36.25,47.8 34,50.05 34,53.2 32.85,54.35 29.8,54.35 28.6,55.55 28.6,69.2 27.25,70.55 27.2,70.55 | 27.2,70.55 v26.5,70.55
  Bottom 0.305: v26.5,70.55 v26.5,70.56 | R36.2 v31.1,89.2
  Bottom 0.406: IC6.6 v26.5,70.56 26.79,70.56 R37.1 | R35.2 v36.25,40.25
N$58
  Bottom 0.305: TUNE_B.2 29.48,88.38 R36.1
N$59
  Bottom 0.406: R38.2 23.3,81.5 22.9,81.1 22.9,69.7 23.3,69.3 IC6.7 25.65,69.3 26.65,68.3 R37.2
N$60  (via drill 0.3)
  Top 0.305: v18.6,79.4 18.65,79.4
  Top 0.406: 18.65,79.4 R38.1 v23.3,84.8
  Bottom 0.406: R39.2 v23.3,84.8 R38.1 | D3.3 v18.6,79.4
N$61
  Bottom 0.406: TUNEIN_A.P$3 24.87,33.03 R40.1
N$62  (via drill 0.3)
  Top 0.305: v13,82.85 16.2,82.85 17.15,81.9 17.15,78.7 18.25,77.6 24.3,77.6 26.25,75.65 v26.3,75.65 26.3,74.85 25.8,74.35 25.8,62.9 27.25,61.45 27.25,55.85 24.95,53.55 24.95,35.65 v23.15,33.85
  Bottom 0.305: IC6.2 26.25,75.64 26.41,75.64 R42.1 | v13,82.85 R41.2 | v23.15,33.85 R40.2
  Bottom 0.406: v26.3,75.65 26.26,75.65 26.25,75.64
N$63
  Bottom 0.406: TUNE_A.2 10.43,82.83 R41.1
N$64
  Bottom 0.305: R42.2 27.05,76.85 27,76.9 IC6.1
  Bottom 0.406: R43.2 24.8,77.01 IC6.1
N$65
  Bottom 0.406: R44.2 R43.1 25.45,84.7 D4.3
N$66
  Bottom 0.305: R45.1 28.45,11.58 ENV_B.P$2
N$67
  Top 0.305: ENV_B.P$3 37.45,12.4 34.95,14.9 34.95,47.15 33.55,48.55 29.3,48.55 26.95,50.9 27,52.5 MOD_B.1
N$68
  Bottom 0.305: ENV_C.P$2 41.97,10.82 R46.1
N$69
  Top 0.305: MOD_C.1 46.02,49.42 45,48.4 45,42.9 48.3,39.6 48.35,14.32 ENV_C.P$3
N$70
  Bottom 0.305: R47.1 51.42,9.3 ENV_D.P$2
N$71
  Top 0.254: ENV_D.P$3 62.97,16.23 61.6,17.6 61.6,19.6 64.65,22.65 64.65,38.8 63.7,39.75 63.7,44.8 MOD_D.1
OUT_L
  Bottom 0.305: OUT_L.P$3 12.17,7.68
  Bottom 0.406: 12.17,7.68 R406.2
OUT_R  (via drill 0.3)
  Top 0.305: v27.65,14.85 27.65,21.65 26.6,22.65 22.9,22.65 22.35,23.2 22.35,34.35 24.25,36.25 24.25,53.4 22.75,54.9 22.75,66.1 22.15,66.7 v19.95,66.7
  Bottom 0.305: OUT_R.P$3 75.67,12.23 73.05,14.85 v27.65,14.85 | v19.95,66.7 R14.2
USB_H_D+
  Top 0.254: X3.3 38,7.45 39.65,9.1 50.55,9.1 51.55,10.1 51.55,15.9 50.1,17.35 50.1,20 51.55,21.45 51.55,29 50.3,30.25 50.3,33.15 52.3,35.15 52.3,49.7 53.62,51.02 USB_H.2
USB_H_D-
  Top 0.254: USB_H.1 53.73,35.78 50.8,32.85 50.8,30.5 52.1,29.2 52.1,21.2 50.7,19.8 50.7,17.6 52.1,16.2 52.1,9.9 50.8,8.6 40.8,8.6 40,7.8 X3.2
USB_H_PWR_EN
  Bottom 0.254: 53.78,56.15 53.95,56.15 54.8,57 57.5,57 57.85,57.35 U3.3 57.85,58.85 58.12,59.12 R21.2
  Bottom 0.305: 53.78,56.15 USB_H.4
USB_H_VBUS  (via drill 0.3)
  Top 0.305: v42.65,6.6 44.05,8 51.1,8 52.7,9.6 52.7,16.45 51.35,17.8 51.35,19.55 52.7,20.9 52.7,29.45 51.4,30.75 51.4,32.35 v53.4,34.35 | USB_H.3 51.65,50.5 51.65,35.7 v50.3,34.35
  Bottom 0.254: 41.8,5.25 41.8,6.55 C22.1 v42.65,6.6 | 41.8,5.2 41.8,5.25 | 41.8,5.25 C21.1
  Bottom 0.305: v50.3,34.35 v53.4,34.35 | USB_H.3 U3.6
  Bottom 0.406: X3.1 42.5,2.95 D5.C 41.8,5.2

### Text on the board
tPlace: Rebel Technology | QuadFM Rev02 | 5v | gnd | 3v3
bPlace: Rebel Technology | QuadFM Rev02